# EAGLE design audio-interface (EAGLE 6.3)
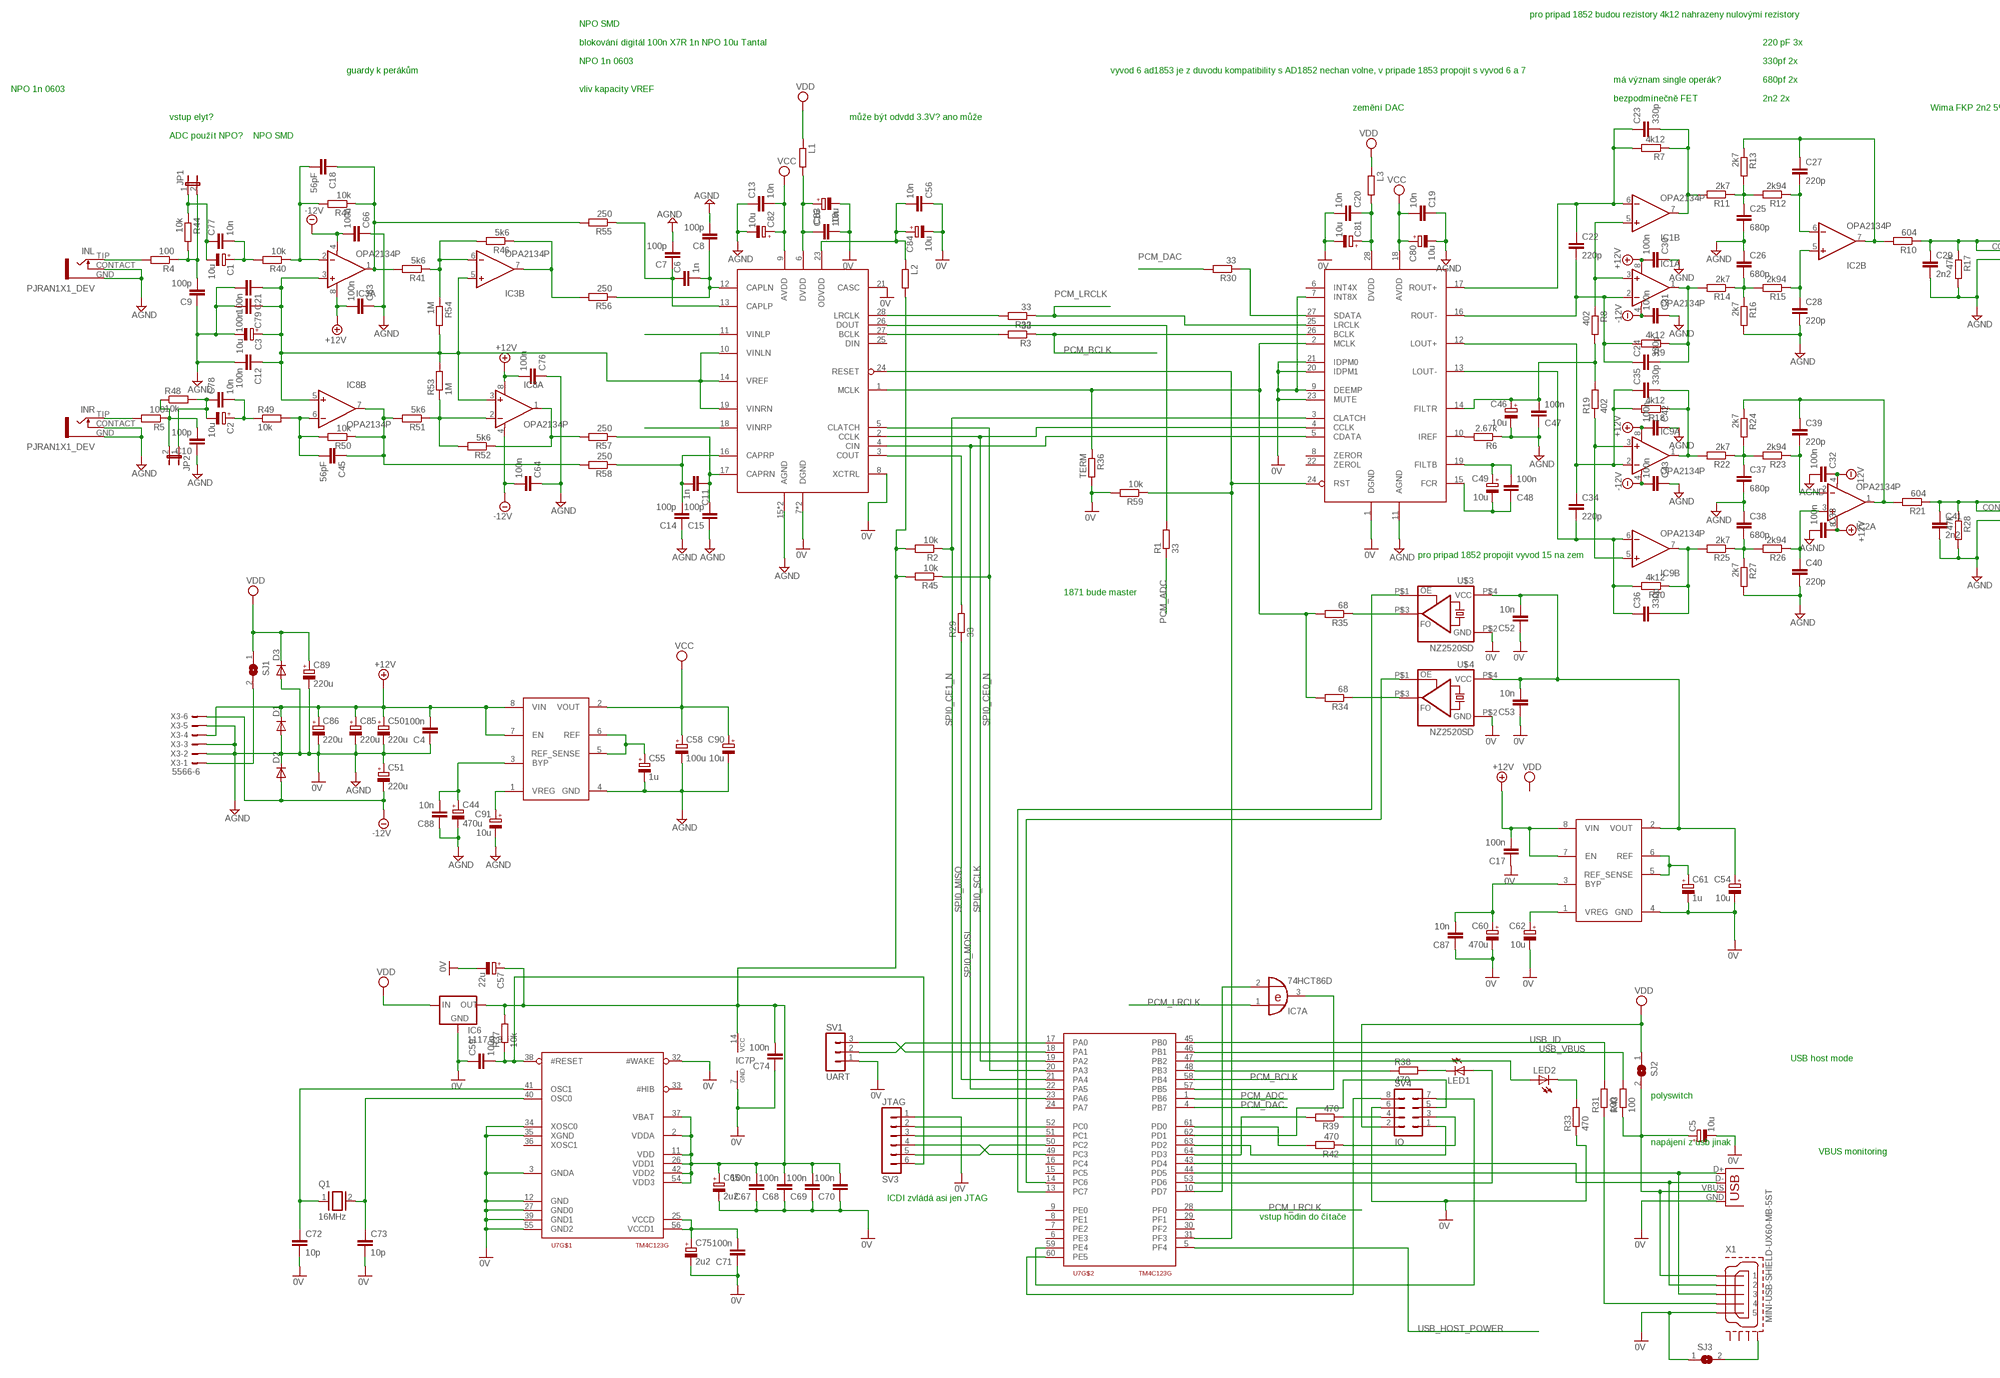
[diagram p0: schematic, sheet 1, part 1 of 2]
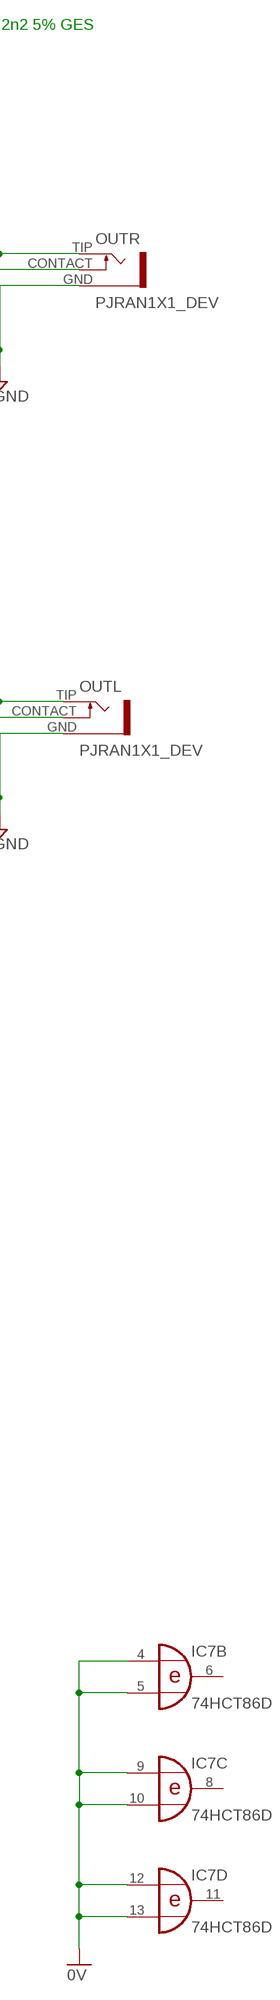
[diagram p1: schematic, sheet 1, part 2 of 2]

## Parts
C1  10u  CPOL-EUE2.5-5  [E2,5-5]
C2  10u  CPOL-EUE2.5-5  [E2,5-5]
C3  10u  CPOL-EUE2.5-7  [E2,5-7]
C4  100n  C-EUC0805  [C0805]
C5  10u  CPOL-EUE2.5-7  [E2,5-7]
C6  1n  C-EUC0805K  [C0805K]
C7  100p  C-EUC0805K  [C0805K]
C8  100p  C-EUC0805K  [C0805K]
C9  100p  C-EUC0805K  [C0805K]
C10  100p  C-EUC0805K  [C0805K]
C11  1n  C-EUC0805K  [C0805K]
C12  100n  C-EUC0805  [C0805]
C13  10n  C-EUC0805  [C0805]
C14  100p  C-EUC0805K  [C0805K]
C15  100p  C-EUC0805K  [C0805K]
C16  10n  C-EUC0805  [C0805]
C17  100n  C-EUC0805  [C0805]
C18  56pF  C-EUC0805K  [C0805K]
C19  10n  C-EUC0805  [C0805]
C20  10n  C-EUC0805  [C0805]
C21  100n  C-EUC0805  [C0805]
C22  220p  C-EUC0805K  [C0805K]
C23  330p  C-EUC0805K  [C0805K]
C24  330p  C-EUC0805K  [C0805K]
C25  680p  C-EU050-050X075  [C050-050X075]
C26  680p  C-EU050-050X075  [C050-050X075]
C27  220p  C-EUC0805K  [C0805K]
C28  220p  C-EUC0805K  [C0805K]
C29  2n2  C-EU050-050X075  [C050-050X075]
C30  100n  C-EUC0805  [C0805]
C31  100n  C-EUC0805  [C0805]
C32  100n  C-EUC0805  [C0805]
C33  100n  C-EUC0805  [C0805]
C34  220p  C-EUC0805K  [C0805K]
C35  330p  C-EUC0805K  [C0805K]
C36  330p  C-EUC0805K  [C0805K]
C37  680p  C-EU050-050X075  [C050-050X075]
C38  680p  C-EU050-050X075  [C050-050X075]
C39  220p  C-EUC0805K  [C0805K]
C40  220p  C-EUC0805K  [C0805K]
C41  2n2  C-EU050-050X075  [C050-050X075]
C42  100n  C-EUC0805  [C0805]
C43  100n  C-EUC0805  [C0805]
C44  470u  CPOL-EUE2.5-7  [E2,5-7]
C45  56pF  C-EUC0805K  [C0805K]
C46  10u  CPOL-EUSMCA  [SMC_A]
C47  100n  C-EUC0805  [C0805]
C48  100n  C-EUC0805  [C0805]
C49  10u  CPOL-EUSMCA  [SMC_A]
C50  220u  CPOL-EUE2.5-7  [E2,5-7]
C51  220u  CPOL-EUE2.5-7  [E2,5-7]
C52  10n  C-EUC0805  [C0805]
C53  10n  C-EUC0805  [C0805]
C54  10u  CPOL-EUCT6032  [CT6032]
C55  1u  CPOL-EUCT3216  [CT3216]
C56  10n  C-EUC0805  [C0805]
C57  22u  CPOL-EUCT6032  [CT6032]
C58  100u  CPOL-EUE2.5-7  [E2,5-7]
C59  100n  C-EUC0805  [C0805]
C60  470u  CPOL-EUE2.5-7  [E2,5-7]
C61  1u  CPOL-EUCT3216  [CT3216]
C62  10u  CPOL-EUCT6032  [CT6032]
C63  100n  C-EUC0805  [C0805]
C64  100n  C-EUC0805  [C0805]
C65  2u2  CPOL-EUCT3216  [CT3216]
C66  100n  C-EUC0805  [C0805]
C67  100n  C-EUC0805  [C0805]
C68  100n  C-EUC0805  [C0805]
C69  100n  C-EUC0805  [C0805]
C70  100n  C-EUC0805  [C0805]
C71  100n  C-EUC0805  [C0805]
C72  10p  C-EUC0805  [C0805]
C73  10p  C-EUC0805  [C0805]
C74  100n  C-EUC0805  [C0805]
C75  2u2  CPOL-EUCT3216  [CT3216]
C76  100n  C-EUC0805  [C0805]
C77  10n  C-EUC0805K  [C0805K]
C78  10n  C-EUC0805K  [C0805K]
C79  100n  C-EUC0805  [C0805]
C80  10u  CPOL-EUSMCA  [SMC_A]
C81  10u  CPOL-EUSMCA  [SMC_A]
C82  10u  CPOL-EUSMCA  [SMC_A]
C83  10u  CPOL-EUSMCA  [SMC_A]
C84  10u  CPOL-EUSMCA  [SMC_A]
C85  220u  CPOL-EUE2.5-7  [E2,5-7]
C86  220u  CPOL-EUE2.5-7  [E2,5-7]
C87  10n  C-EUC0805  [C0805]
C88  10n  C-EUC0805  [C0805]
C89  220u  CPOL-EUE2.5-7  [E2,5-7]
C90  10u  CPOL-EUCT6032  [CT6032]
C91  10u  CPOL-EUCT6032  [CT6032]
D1  DIODE-MINIMELF  [MINIMELF]
D2  DIODE-MINIMELF  [MINIMELF]
D3  DIODE-MINIMELF  [MINIMELF]
IC1  OPA2134P  [DIL08]
IC2  OPA2134P  [DIL08]
IC3  OPA2134P  [DIL08]
IC6  1117 3.3  LM1117  [SOT223]
IC7  74HCT86D  [SO14]
IC8  OPA2134P  [DIL08]
IC9  OPA2134P  [DIL08]
INL  PJRAN1X1_DEV  [PJRAN1X1]
INR  PJRAN1X1_DEV  [PJRAN1X1]
JP1  JP1E  [JP1]
JP2  JP1E  [JP1]
L1  R-EU_R0805  [R0805]
L2  R-EU_R0805  [R0805]
L3  R-EU_R0805  [R0805]
LED1  LED3MM  [LED3MM]
LED2  LED3MM  [LED3MM]
OUTL  PJRAN1X1_DEV  [PJRAN1X1]
OUTR  PJRAN1X1_DEV  [PJRAN1X1]
Q1  16MHz  XTAL/S  [QS]
R1  33  R-EU_R0805  [R0805]
R2  10k  R-EU_R0805  [R0805]
R3  33  R-EU_R0805  [R0805]
R4  100  R-EU_M0805  [M0805]
R5  100  R-EU_M0805  [M0805]
R6  2.67k  R-EU_M1406  [M1406]
R7  4k12  R-EU_M1206  [M1206]
R8  402  R-EU_M1206  [M1206]
R9  4k12  R-EU_M1206  [M1206]
R10  604  R-EU_M1206  [M1206]
R11  2k7  R-EU_M1206  [M1206]
R12  2k94  R-EU_M1206  [M1206]
R13  2k7  R-EU_M1206  [M1206]
R14  2k7  R-EU_M1206  [M1206]
R15  2k94  R-EU_M1206  [M1206]
R16  2k7  R-EU_M1206  [M1206]
R17  47k  R-EU_M1206  [M1206]
R18  4k12  R-EU_M1206  [M1206]
R19  402  R-EU_M1206  [M1206]
R20  4k12  R-EU_M1206  [M1206]
R21  604  R-EU_M1206  [M1206]
R22  2k7  R-EU_M1206  [M1206]
R23  2k94  R-EU_M1206  [M1206]
R24  2k7  R-EU_M1206  [M1206]
R25  2k7  R-EU_M1206  [M1206]
R26  2k94  R-EU_M1206  [M1206]
R27  2k7  R-EU_M1206  [M1206]
R28  47k  R-EU_M1206  [M1206]
R29  33  R-EU_R0805  [R0805]
R30  33  R-EU_R0805  [R0805]
R31  100  R-EU_R0805  [R0805]
R32  33  R-EU_R0805  [R0805]
R33  470  R-EU_R0805  [R0805]
R34  68  R-EU_M1206  [M1206]
R35  68  R-EU_M1206  [M1206]
R36  TERM  R-EU_R0805  [R0805]
R37  10k  R-EU_R0805  [R0805]
R38  470  R-EU_R0805  [R0805]
R39  470  R-EU_R0805  [R0805]
R40  10k  R-EU_M1206  [M1206]
R41  5k6  R-EU_M1206  [M1206]
R42  470  R-EU_R0805  [R0805]
R43  100  R-EU_R0805  [R0805]
R44  10k  R-EU_M1206  [M1206]
R45  10k  R-EU_R0805  [R0805]
R46  5k6  R-EU_M1206  [M1206]
R47  10k  R-EU_M1206  [M1206]
R48  10k  R-EU_M1206  [M1206]
R49  10k  R-EU_M1206  [M1206]
R50  10k  R-EU_M1206  [M1206]
R51  5k6  R-EU_M1206  [M1206]
R52  5k6  R-EU_M1206  [M1206]
R53  1M  R-EU_M1206  [M1206]
R54  1M  R-EU_M1206  [M1206]
R55  250  R-EU_M1206  [M1206]
R56  250  R-EU_M1206  [M1206]
R57  250  R-EU_M1206  [M1206]
R58  250  R-EU_M1206  [M1206]
R59  10k  R-EU_R0805  [R0805]
SJ1  SJ  [SJ]
SJ2  SJ  [SJ]
SJ3  SJ  [SJ]
SV1  UART  MA03-1  [MA03-1]
SV3  JTAG  MA06-1  [MA06-1]
SV4  IO  MA04-2  [MA04-2]
U1  AD1853  [SSOP-28]
U2  AD1871  [SSOP-28]
U5  ADM7150  [SO8-COOL]
U6  ADM7150  [SO8-COOL]
U7  TM4C123G  [LQFP64]
U$3  NZ2520SD  OSC-3ST  [OSC2X2.5]
U$4  NZ2520SD  OSC-3ST  [OSC2X2.5]
X1  MINI-USB-SHIELD-UX60-MB-5ST  [UX60-MB-5ST]
X3  5566-6  [5566-6]
X7  USB-B-H  [USB-B-H]

## Nets
+12V: C4.2 C17.2 C30.2 C33.1 C42.2 C50.+ C63.2 C76.2 C85.+ C86.+ D1.C IC1.8(A:V+) IC2.8(A:V+) IC3.8(A:V+) IC8.8(A:V+) IC9.8(A:V+) U5.7(EN) U5.8(VIN) U6.7(EN) U6.8(VIN) X3.4
-12V: C31.2 C32.1 C43.2 C51.- C64.2 C66.2 D2.A IC1.4(A:V-) IC2.4(A:V-) IC3.4(A:V-) IC8.4(A:V-) IC9.4(A:V-) X3.6
AGND: C3.- C4.1 C5.- C7.2 C8.2 C9.1 C10.1 C12.2 C13.1 C14.1 C15.1 C16.2 C17.1 C19.1 C20.2 C21.2 C25.2 C26.1 C28.2 C29.2 C30.1 C31.1 C32.2 C33.2 C37.2 C38.1 C40.2 C41.2 C42.1 C43.1 C44.- C46.- C47.1 C50.- C51.+ C52.1 C53.1 C54.- C55.- C56.1 C57.- C58.- C59.1 C60.- C61.- C62.- C63.1 C64.1 C65.- C66.1 C67.1 C68.1 C69.1 C70.1 C71.1 C72.2 C73.2 C74.1 C75.- C76.1 C79.2 C80.- C81.- C82.- C83.- C84.- C85.- C86.- C87.1 C88.1 C89.- C90.- C91.- D1.A D2.C D3.A IC6.1(GND) IC7.4(B:I0) IC7.5(B:I1) IC7.7(P:GND) IC7.9(C:I0) IC7.10(C:I1) IC7.12(D:I0) IC7.13(D:I1) INL.CONTACT(SWITCH) INL.GND INR.CONTACT(SWITCH) INR.GND OUTL.GND OUTR.GND R6.1 R16.2 R17.2 R27.2 R28.2 R33.1 R36.2 R59.2 SJ3.1 SV1.1 SV3.1 SV4.6 U1.1(DGND) U1.7(INT8X) U1.9(DEEMP) U1.11(AGND) U1.20(IDPM1) U1.21(IDPM0) U1.23(MUTE) U2.7(DGND) U2.8(XCTRL) U2.15(AGND) U2.20(AGND) U2.21(CASC) U2.22(DGND) U5.4(GND) U6.4(GND) U7.3(GNDA) U7.12(GND) U7.27(GND0) U7.32(#WAKE) U7.34(XOSC0) U7.35(XGND) U7.39(GND1) U7.55(GND2) U$3.P$2(GND) U$4.P$2(GND) X1.5 X3.2 X3.3 X3.5 X7.GND ; supply symbol labelled 0V
N$1: R59.1 U1.24(RST) U2.24(RESET) U7.31(PF3)
N$2: R35.1 U$3.P$3(FO)
N$3: R32.2 U2.28(LRCLK)
N$4: IC7.3(A:O) U7.57(PB5)
N$5: R1.2 U2.26(DOUT)
N$6: C55.+ U5.5(REF_SENSE) U5.6(REF)
N$7: C91.+ U5.1(VREG)
N$8: C44.+ C88.2 U5.3(BYP)
N$9: R34.2 R35.2 R36.1 U1.2(MCLK) U2.1(MCLK)
N$10: C6.2 C8.1 R56.1 U2.12(CAPLN)
N$11: R29.2 U2.3(COUT)
N$12: C60.+ C87.2 U6.3(BYP)
N$13: C62.+ U6.1(VREG)
N$14: C61.+ U6.5(REF_SENSE) U6.6(REF)
N$15: C1.+ C77.2 R40.2
N$16: IC3.7(B:OUT) R46.1 R56.2
N$17: C71.2 C75.+ U7.25(VCCD) U7.56(VCCD1)
N$18: C22.2 C24.1 IC1.2(A:-IN) R9.2 U1.16(ROUT-)
N$19: C6.1 C7.1 R55.1 U2.13(CAPLP)
N$20: C45.1 IC8.7(B:OUT) R50.1 R51.2 R58.2
N$21: C11.1 C15.2 R57.1 U2.17(CAPRN)
N$22: C22.1 C23.1 IC1.6(B:-IN) R7.2 U1.17(ROUT+)
N$23: SV1.3 U7.18(PA1)
N$24: IC8.1(A:OUT) R52.1 R57.2
N$25: C24.2 IC1.1(A:OUT) R9.1 R14.2
N$26: C11.2 C14.2 R58.1 U2.16(CAPRP)
N$27: IC8.2(A:-IN) R51.1 R52.2 R53.1
N$28: IC3.6(B:-IN) R41.1 R46.2 R54.1
N$29: C3.+ C12.1 C21.1 C79.1 IC3.3(A:+IN) IC3.5(B:+IN) IC8.3(A:+IN) IC8.5(B:+IN) R53.2 R54.2 U2.10(VINLN) U2.14(VREF) U2.19(VINRN)
N$30: C23.2 IC1.7(B:OUT) R7.1 R11.2
N$31: C46.+ C47.2 R8.2 R19.2 U1.14(FILTR)
N$32: C26.2 R14.1 R15.2 R16.1
N$33: R6.2 U1.10(IREF)
N$34: C25.1 R11.1 R12.2 R13.2
N$35: C27.2 IC2.6(B:-IN) R12.1
N$36: C28.1 IC2.5(B:+IN) R15.1
N$37: C27.1 IC2.7(B:OUT) R10.2 R13.1
N$38: C48.2 C49.+ U1.19(FILTB)
N$39: C29.1 OUTR.CONTACT(SWITCH) OUTR.TIP(HOT) R10.1 R17.1
N$40: C48.1 C49.- U1.15(FCR)
N$41: SV3.5 U7.50(PC2)
N$42: C34.2 C36.1 IC9.6(B:-IN) R20.2 U1.13(LOUT-)
N$43: C36.2 IC9.7(B:OUT) R20.1 R25.2
N$44: IC9.3(A:+IN) IC9.5(B:+IN) R19.1
N$45: C35.2 IC9.1(A:OUT) R18.1 R22.2
N$46: C38.2 R25.1 R26.2 R27.1
N$47: C37.1 R22.1 R23.2 R24.2
N$48: C39.2 IC2.2(A:-IN) R23.1
N$49: C40.1 IC2.3(A:+IN) R26.1
N$50: C39.1 IC2.1(A:OUT) R21.2 R24.1
N$51: R3.2 U2.27(BCLK)
N$52: IC1.3(A:+IN) IC1.5(B:+IN) R8.1
N$53: C18.1 IC3.1(A:OUT) R41.2 R47.1 R55.2
N$54: INR.TIP(HOT) R5.2
N$55: C10.2 JP2.2 R5.1 R48.1
N$56: R34.1 U$4.P$3(FO)
N$57: C34.1 C35.1 IC9.2(A:-IN) R18.2 U1.12(LOUT+)
N$58: C2.+ C78.2 R49.1
N$59: C72.1 Q1.1 U7.41(OSC1)
N$60: C52.2 C53.2 C54.+ U6.2(VOUT) U$3.P$4(VCC) U$4.P$4(VCC)
N$61: C45.2 IC8.6(B:-IN) R49.2 R50.2
N$62: C73.1 Q1.2 U7.40(OSC0)
N$63: SV4.1 U7.63(PD2)
N$64: SV1.2 U7.17(PA0)
N$65: R39.2 U7.64(PD3)
N$66: SV3.4 U7.49(PC3)
N$67: LED1.A U7.53(PD6)
N$68: C18.2 IC3.2(A:-IN) R40.1 R47.2
N$69: C9.2 JP1.2 R4.1 R44.2
N$70: INL.TIP(HOT) R4.2
N$71: U7.44(PD5) X1.3 X7.D+
N$72: U7.43(PD4) X1.2 X7.D-
N$73: C59.2 R37.1 SV3.6 U7.38(#RESET)
N$74: SV3.2 U7.52(PC0)
N$75: SV3.3 U7.51(PC1)
N$76: IC7.2(A:I1) U7.10(PD7)
N$77: LED2.K(C) R33.2
N$78: LED1.K(C) R38.2
N$79: U7.14(PC6) U$4.P$1(OE)
N$80: U7.13(PC7) U$3.P$1(OE)
N$81: R42.2 U7.61(PD0)
N$82: U2.11(VINLP)
N$83: C16.1 C83.+ L1.2 U2.6(DVDD)
N$84: C56.2 C84.+ L2.1 U2.23(ODVDD)
N$85: R38.1 U7.48(PB3)
N$86: U2.18(VINRP)
N$87: C57.+ C65.+ C67.2 C68.2 C69.2 C70.2 C74.2 IC6.2(OUT) IC7.14(P:VCC) L2.2 R2.2 R37.2 R45.2 U7.2(VDDA) U7.11(VDD) U7.26(VDD1) U7.37(VBAT) U7.42(VDD2) U7.54(VDD3)
N$88: R30.1 U1.27(SDATA)
N$89: R39.1 SV4.4
N$90: SV4.8 U7.60(PE5)
N$91: SV4.5 U7.62(PD1)
N$92: R42.1 SV4.3
N$93: SV4.7 U7.59(PE4)
N$94: C1.- C77.1 JP1.1 R44.1
N$95: C2.- C78.1 JP2.1 R48.2
N$96: LED2.A U7.47(PB2)
N$97: C20.1 C81.+ L3.2 U1.28(DVDD)
N$98: SJ1.2 X3.1
N$99: C5.+ R43.1 SJ2.2 X1.1 X7.VBUS
N$101: R31.1 X1.4
N$102: SJ3.2 X1.M4(GND4)
OUTL: C41.1 OUTL.CONTACT(SWITCH) OUTL.TIP(HOT) R21.1 R28.1
PCM_ADC: R1.1 U7.1(PB6)
PCM_BCLK: R3.1 U1.26(BCLK) U7.58(PB4)
PCM_DAC: R30.2 U7.4(PB7)
PCM_LRCLK: IC7.1(A:I0) R32.1 U1.25(LRCLK) U7.28(PF0)
SPI0_CE0_N: R45.1 U2.5(CLATCH) U7.20(PA3)
SPI0_CE1_N: R2.1 U1.3(CLATCH) U7.23(PA6)
SPI0_MISO: R29.1 U7.21(PA4)
SPI0_MOSI: U1.5(CDATA) U2.4(CIN) U7.22(PA5)
SPI0_SCLK: U1.4(CCLK) U2.2(CCLK) U7.19(PA2)
USB_HOST_POWER: U7.5(PF4)
USB_ID: R31.2 U7.45(PB0)
USB_VBUS: R43.2 U7.46(PB1)
VCC: C13.2 C19.2 C58.+ C80.+ C82.+ C90.+ U1.18(AVDD) U2.9(AVDD) U5.2(VOUT)
VDD: C89.+ D3.C IC6.3(IN) L1.1 L3.1 SJ1.1 SJ2.1 SV4.2
Unconnected: IC7.6(B:O) IC7.8(C:O) IC7.11(D:O) U1.6(INT4X) U1.8(ZEROR) U1.22(ZEROL) U2.25(DIN) U7.6(PE3) U7.7(PE2) U7.8(PE1) U7.9(PE0) U7.15(PC5) U7.16(PC4) U7.24(PA7) U7.29(PF1) U7.30(PF2) U7.33(#HIB) U7.36(XOSC1) X1.M1(GND1) X1.M2(GND2) X1.M3(GND3)

## Notes on the sheet
- pro pripad 1852 budou rezistory 4k12 nahrazeny nulovými rezistory
- NPO SMD
- blokování digitál 100n X7R 1n NPO 10u Tantal | 220 pF 3x
- NPO 1n 0603 | 330pf 2x
- guardy k perákům | vyvod 6 ad1853 je z duvodu kompatibility s AD1852 nechan volne, v pripade 1853 propojit s vyvod 6 a 7
- má význam single operák? | 680pf 2x
- NPO 1n 0603 | vliv kapacity VREF
- bezpodmínečně FET | 2n2 2x
- zemění DAC | Wima FKP 2n2 5% GES
- vstup elyt? | může být odvdd 3.3V? ano může
- ADC použít NPO? | NPO SMD
- pro pripad 1852 propojit vyvod 15 na zem
- 1871 bude master
- USB host mode
- polyswitch
- napájení z usb jinak
- VBUS monitoring
- ICDI zvládá asi jen JTAG
- vstup hodin do čítače

## Library data of the parts
C1-C3 C5 C44 C46 C49-C51 C54 C55 C57 C58 C60-C62 C65 C75 C80-C86 C89-C91 = rcl:CPOL-EU: POLARIZED CAPACITOR, European symbol
C4 C6-C43 C45 C47 C48 C52 C53 C56 C59 C63 C64 C66-C74 C76-C79 C87 C88 = rcl:C-EU: CAPACITOR, European symbol
D1-D3 = diode:DIODE-: DIODE
IC1-IC3 IC8 IC9 = burr-brown:OPA2134: Operational Amplifier; MF: TEXAS INSTRUMENTS; MPN: OPA2134PA; OC_FARNELL: 1097574; OC_NEWARK: 74K3897
IC6 = v-reg-3:LM1117
IC7 = 74xx-eu:74*86: Quad 2-input EXCLUSIVE-OR (XOR) gate
INL INR OUTL OUTR = cinch:PJRAN1X1_DEV
JP1 JP2 = jumper:JP1E: JUMPER
L1-L3 R1-R59 = rcl:R-EU_: RESISTOR, European symbol
LED1 LED2 = led:LED: LED OSRAM: - CHIPLED LG R971, LG N971, LY N971, LG Q971, LY Q971, LO R971, LY R971 LH N974, LH R974 LS Q976, LO Q976, LY Q976 LO Q996 - Hyper CHIPLED LW Q18S LB Q993, LB Q99A, LB R99A - SideLED LS A670, LO A670, LY A670, LG A670, LP A670 LB A673, LV A673, LT A673, LW A673 LH A674 LY A675 LS A676, LA A676, LO A676, LY A676, LW A676 LS A679, LY A679, LG A679 - Hyper Micro SIDELED® LS Y876, LA Y876, LO Y876, LY Y876 LT Y87S - SmartLED LW L88C, LW L88S LB L89C, LB L89S, LG L890 LS L89K, LO L89K, LY L89K LS L896, LA L896, LO L896, LY L896 - TOPLED LS T670, LO T670, LY T670, LG T670, LP T670 LSG T670, LSP T670, LSY T670, LOP T670, LYG T670 LG T671, LOG T671, LSG T671 LB T673, LV T673, LT T673, LW T673 LH T674 LS T676, LA T676, LO T676, LY T676, LB T676, LH T676, LSB T676, LW T676 LB T67C, LV T67C, LT T67C, LS T67K, LO T67K, LY T67K, LW E67C LS E67B, LA E67B, LO E67B, LY E67B, LB E67C, LV E67C, LT E67C LW T67C LS T679, LY T679, LG T679 LS T770, LO T770, LY T770, LG T770, LP T770 LB T773, LV T773, LT T773, LW T773 LH T774 LS E675, LA E675, LY E675, LS T675 LS T776, LA T776, LO T776, LY T776, LB T776 LHGB T686 LT T68C, LB T68C - Hyper Mini TOPLED® LB M676 - Mini TOPLED Santana® LG M470 LS M47K, LO M47K, LY M47K Source: http://www.osram.convergy.de LUXEON: - LUMILED® LXK2-PW12-R00, LXK2-PW12-S00, LXK2-PW14-U00, LXK2-PW14-V00 LXK2-PM12-R00, LXK2-PM12-S00, LXK2-PM14-U00 LXK2-PE12-Q00, LXK2-PE12-R00, LXK2-PE12-S00, LXK2-PE14-T00, LXK2-PE14-U00 LXK2-PB12-K00, LXK2-PB12-L00, LXK2-PB12-M00, LXK2-PB14-N00, LXK2-PB14-P00, LXK2-PB14-Q00 LXK2-PR12-L00, LXK2-PR12-M00, LXK2-PR14-Q00, LXK2-PR14-R00 LXK2-PD12-Q00, LXK2-PD12-R00, LXK2-PD12-S00 LXK2-PH12-R00, LXK2-PH12-S00 LXK2-PL12-P00, LXK2-PL12-Q00, LXK2-PL12-R00 Source: www.luxeon.com KINGBRIGHT: KA-3528ASYC Source: www.kingbright.com
Q1 = special:XTAL/S: CRYSTAL
SJ1-SJ3 = jumper:SJ: SMD solder JUMPER
SV1 = con-lstb:MA03-1: PIN HEADER; OC_FARNELL: unknown; OC_NEWARK: unknown
SV3 = con-lstb:MA06-1: PIN HEADER; OC_FARNELL: unknown; OC_NEWARK: unknown
SV4 = con-lstb:MA04-2: PIN HEADER; OC_FARNELL: unknown; OC_NEWARK: unknown
U1 = analog-devices:AD1853
U2 = analog-devices:AD1871
U5 U6 = analog-devices:ADM7150
U7 = tm4c123:TM4C123G: TM4C123G micro in LQFP64 package
U$3 U$4 = ndk:OSC-3ST
X1 = usb_con-update:MINI-USB-SHIELD-: MINI USB Connector Source: http://www.hirose.co.jp/cataloge_hp/e24000019.pdf
X3 = con-molex:5566-6: Mini FIT connector 6 pol Source: http://www.molex.com; MPN: 95566-61002; OC_FARNELL: unknown; OC_NEWARK: 22K8620
X7 = con-usb:USB: USB Connectors

## Board
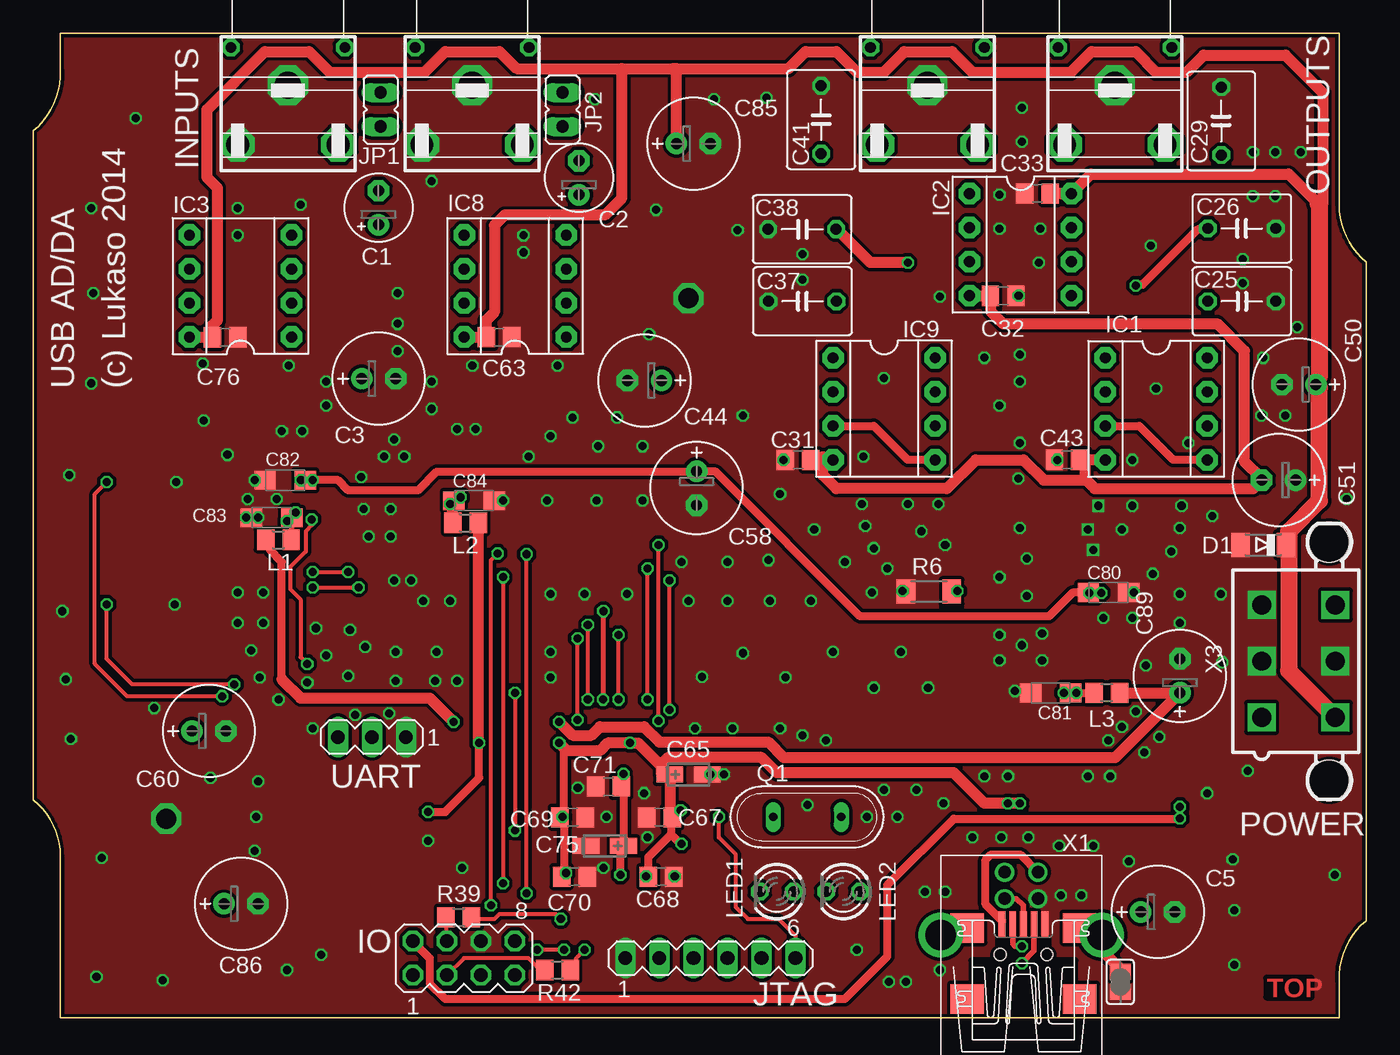
[diagram p2: board, top side]
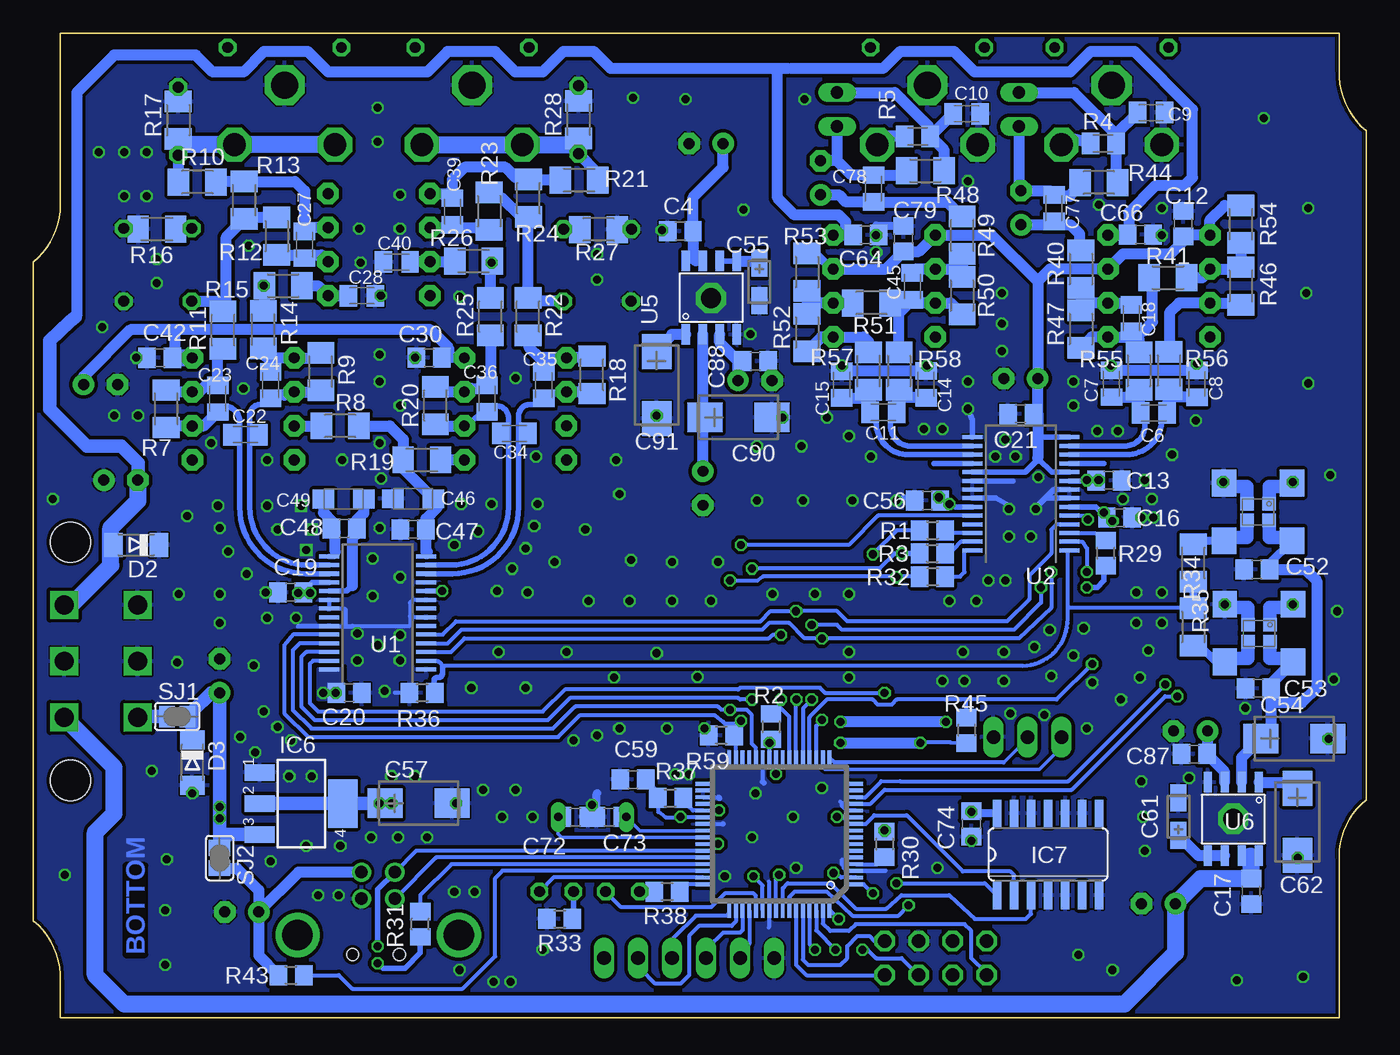
[diagram p3: board, bottom side, seen from below]

Size 99.5 x 73.5 mm. Coordinates in mm from the lower left corner, seen from the top.
Outline: 2,12.05 arc51 0,16.25 0,66.25 arc52 2,70.75 2,73.5 97.5,73.5 97.5,60.73 arc51 99.5,56.43 99.5,7.25 arc52 97.5,2.75 97.5,0 2,0 2,12
Copper layers (1*16): Top 0.035mm / dielectric 1.5mm / Bottom 0.035mm
Design rules "ITEADstudio_DRC *": minimum track width 6mil, minimum drill 12mil, track to track 6mil, track to pad 6mil, pad to pad 6mil, via to via 6mil, smd to smd 0mil, copper to edge 10mil, drill to drill 10mil, minimum pad ring 10mil, minimum via ring 6mil, stop-mask expansion 2mil, vias tented up to drill 100mil, thermal gap 5mil

### Footprints (pad centres in the part's own frame; a part is rotated, then mirrored left to right if it is on the bottom)
E2,5-5 = drill 0.813 pad 1.6: + -1.27,0 | drill 0.813 pad 1.6 octagon: - 1.27,0
E2,5-7 = drill 0.813 pad 1.6: + -1.27,0 | drill 0.813 pad 1.6 octagon: - 1.27,0
C0805 = smd 1.3 x 1.5: 1 -0.95,0; 2 0.95,0
C0805K = smd 1.3 x 1.6: 1 -1,0; 2 1,0
C050-050X075 = drill 0.813 octagon: 1 -2.54,0; 2 2.54,0
SMC_A = smd 1.6 x 1.4: + -1.5,0; - 1.5,0
CT6032 = smd 2.6 x 2.2: + -2.5,0; - 2.5,0
CT3216 = smd 2 x 1.2: + -1.4,0; - 1.4,0
MINIMELF = smd 1.4 x 1.8: A 1.7,0; C -1.7,0
DIL08 = drill 0.813 pad 1.6 octagon: 1 -3.81,-3.81; 2 -1.27,-3.81; 3 1.27,-3.81; 4 3.81,-3.81; 5 3.81,3.81; 6 1.27,3.81; 7 -1.27,3.81; 8 -3.81,3.81
SOT223 = smd 1.219 x 2.235: 1 -2.311,-3.099; 2 0,-3.099; 3 2.311,-3.099 | smd 3.6 x 2.2: 4 0,3.099
SO14 = smd 0.66 x 2.032: 1 -3.81,-3.073; 2 -2.54,-3.073; 3 -1.27,-3.073; 4 0,-3.073; 5 1.27,-3.073; 6 2.54,-3.073; 7 3.81,-3.073; 8 3.81,3.073; 9 2.54,3.073; 10 1.27,3.073; 11 0,3.073; 12 -1.27,3.073; 13 -2.54,3.073; 14 -3.81,3.073
PJRAN1X1 = drill 1.7 pad 2.54 octagon: CONTACT -3.75,-8.05; TIP 3.75,-8.05 | drill 2 pad 3 octagon: GND 0,-3.6 | drill 0.8 pad 1.016 octagon: P$1 4.25,-0.8; P$2 -4.25,-0.8
JP1 = drill 0.914 long: 1 0,-1.27; 2 0,1.27
R0805 = smd 1.3 x 1.5: 1 -0.95,0; 2 0.95,0
LED3MM = drill 0.813 octagon: A -1.27,0; K 1.27,0
QS = drill 0.61 long: 1 -2.54,0; 2 2.54,0
M0805 = smd 1.3 x 1.6: 1 -0.95,0; 2 0.95,0
M1406 = smd 1.4 x 1.8: 1 -1.7,0; 2 1.7,0
M1206 = smd 1.6 x 2: 1 -1.4,0; 2 1.4,0
SJ = smd 1.168 x 1.6: 1 -0.762,0; 2 0.762,0
MA03-1 = drill 1.016 long: 1 -2.54,0; 2 0,0; 3 2.54,0
MA06-1 = drill 1.016 long: 1 -6.35,0; 2 -3.81,0; 3 -1.27,0; 4 1.27,0; 5 3.81,0; 6 6.35,0
MA04-2 = drill 1.016 octagon: 1 -3.81,-1.27; 2 -3.81,1.27; 3 -1.27,-1.27; 4 -1.27,1.27; 5 1.27,-1.27; 6 1.27,1.27; 7 3.81,-1.27; 8 3.81,1.27
SSOP-28 = smd 0.3 x 1.5: 1 -4.225,-3.625; 2 -3.575,-3.625; 3 -2.925,-3.625; 4 -2.275,-3.625; 5 -1.625,-3.625; 6 -0.975,-3.625; 7 -0.325,-3.625; 8 0.325,-3.625; 9 0.975,-3.625; 10 1.625,-3.625; 11 2.275,-3.625; 12 2.925,-3.625; 13 3.575,-3.625; 14 4.225,-3.625; 15 4.225,3.625; 16 3.575,3.625; 17 2.925,3.625; 18 2.275,3.625; 19 1.625,3.625; 20 0.975,3.625; 21 0.325,3.625; 22 -0.325,3.625; 23 -0.975,3.625; 24 -1.625,3.625; 25 -2.275,3.625; 26 -2.925,3.625; 27 -3.575,3.625; 28 -4.225,3.625
SO8-COOL = smd 0.61 x 1.524: 1 -1.905,-2.743; 2 -0.635,-2.743; 3 0.635,-2.743; 4 1.905,-2.743; 5 1.905,2.743; 6 0.635,2.743; 7 -0.635,2.743; 8 -1.905,2.743
LQFP64 = smd 1.1 x 0.285: 1 -5.7,3.75; 2 -5.7,3.25; 3 -5.7,2.75; 4 -5.7,2.25; 5 -5.7,1.75; 6 -5.7,1.25; 7 -5.7,0.75; 8 -5.7,0.25; 9 -5.7,-0.25; 10 -5.7,-0.75; 11 -5.7,-1.25; 12 -5.7,-1.75; 13 -5.7,-2.25; 14 -5.7,-2.75; 15 -5.7,-3.25; 16 -5.7,-3.75; 33 5.7,-3.75; 34 5.7,-3.25; 35 5.7,-2.75; 36 5.7,-2.25; 37 5.7,-1.75; 38 5.7,-1.25; 39 5.7,-0.75; 40 5.7,-0.25; 41 5.7,0.25; 42 5.7,0.75; 43 5.7,1.25; 44 5.7,1.75; 45 5.7,2.25; 46 5.7,2.75; 47 5.7,3.25; 48 5.7,3.75 | smd 0.285 x 1.1: 17 -3.75,-5.7; 18 -3.25,-5.7; 19 -2.75,-5.7; 20 -2.25,-5.7; 21 -1.75,-5.7; 22 -1.25,-5.7; 23 -0.75,-5.7; 24 -0.25,-5.7; 25 0.25,-5.7; 26 0.75,-5.7; 27 1.25,-5.7; 28 1.75,-5.7; 29 2.25,-5.7; 30 2.75,-5.7; 31 3.25,-5.7; 32 3.75,-5.7; 49 3.75,5.7; 50 3.25,5.7; 51 2.75,5.7; 52 2.25,5.7; 53 1.75,5.7; 54 1.25,5.7; 55 0.75,5.7; 56 0.25,5.7; 57 -0.25,5.7; 58 -0.75,5.7; 59 -1.25,5.7; 60 -1.75,5.7; 61 -2.25,5.7; 62 -2.75,5.7; 63 -3.25,5.7; 64 -3.75,5.7
OSC2X2.5 = smd 1 x 1: 1 0,-1.25; 2 1.65,-1.25; 3 1.65,0; 4 0,0 | smd 1.8 x 2: P$1 -1.714,-2.794; P$2 3.365,-2.794; P$3 3.365,1.524; P$4 -1.714,1.524
UX60-MB-5ST = smd 2 x 0.5: 1 2.25,1.6; 2 2.25,0.8; 3 2.25,0; 4 2.25,-0.8; 5 2.25,-1.6 | smd 2.2 x 2.5: M1 -3.3,-4.2; M2 -3.3,4.2; M3 2,4.2; M4 2,-4.2 | hole 0.9: 0,-1.75; 0,1.75
5566-6 = drill 1.4 square: 1 4.2,-2.75; 2 0,-2.75; 3 -4.2,-2.75; 4 4.2,2.75; 5 0,2.75; 6 -4.2,2.75 | hole 3: 8.9,2.29; -8.9,2.29
USB-B-H = drill 0.914: D+ 0,1.25; D- 1.981,1.25; GND 0,-1.25; VBUS 1.981,-1.25 | drill 2.286: P$1 -2.718,-6.02; P$2 -2.718,6.02

### Placement (x,y rotation side)
C1  25.76,60.49 90 top
C2  40.73,62.73 90 top
C3  25.78,47.73 0 top
C4  51.2,58.73 0 bottom
C5  83.95,7.89 0 top
C6  15.84,45.16 0 bottom
C7  19.01,47.35 90 bottom
C8  12.63,47.34 90 bottom
C9  16.04,67.6 180 bottom
C10  29.81,67.5 180 bottom
C11  36.03,45.21 0 bottom
C12  13.65,59.29 90 bottom
C13  19.19,40.13 180 bottom
C14  32.85,47.29 270 bottom
C15  39.15,47.28 270 bottom
C16  18.4,37.34 0 bottom
C17  8.57,9.43 90 bottom
C18  17.52,52.25 90 bottom
C19  80.3,31.77 0 bottom
C20  75.94,24.26 0 bottom
C21  25.79,45.09 180 bottom
C22  83.67,43.54 0 bottom
C23  85.74,46.23 90 bottom
C24  81.79,47.25 90 bottom
C25  90.23,53.5 0 top
C26  90.23,58.94 180 top
C27  79.26,57.72 270 bottom
C28  74.99,53.92 0 bottom
C29  88.69,66.96 90 top
C30  69.96,49.28 0 bottom
C31  57.09,41.65 0 top
C32  72.41,53.9 0 top
C33  74.97,61.55 180 top
C34  63.6,43.63 180 bottom
C35  61.39,47.25 90 bottom
C36  65.63,46.23 90 bottom
C37  57.42,53.5 180 top
C38  57.39,58.88 0 top
C39  68.22,60.2 270 bottom
C40  72.38,56.43 180 bottom
C41  58.81,67.06 90 top
C42  90.07,49.28 0 bottom
C43  77.18,41.66 0 top
C44  45.62,47.59 180 top
C45  33.88,54.62 90 bottom
C46  71.15,38.75 180 bottom
C47  71.15,36.47 0 bottom
C48  76.3,36.53 0 bottom
C49  76.34,38.74 180 bottom
C50  94.49,47.28 180 top
C51  92.98,40.14 180 top
C52  8.16,33.47 0 bottom
C53  8.04,24.6 0 bottom
C54  5.36,20.84 0 bottom
C55  45.3,54.95 270 bottom
C56  32.75,38.63 0 bottom
C57  70.74,16.02 0 bottom
C58  49.52,39.54 270 top
C59  54.74,17.78 0 bottom
C60  13.1,21.41 0 top
C61  14.01,15.02 90 bottom
C62  5.12,14.63 270 bottom
C63  34.76,50.82 180 top
C64  37.35,58.46 180 bottom
C65  48.91,18.16 0 top
C66  16.84,58.48 180 bottom
C67  46.74,14.97 0 top
C68  46.87,10.53 180 top
C69  40.26,14.97 180 top
C70  40.39,10.53 180 top
C71  42.93,17.26 0 top
C72  59.04,14.99 0 bottom
C73  56.5,14.99 180 bottom
C74  29.47,14.47 90 bottom
C75  42.66,12.83 180 top
C76  14.32,50.81 180 top
C77  23.3,60.46 270 bottom
C78  36.78,61.92 270 bottom
C79  34.55,58.17 90 bottom
C80  80.27,31.75 0 top
C81  75.95,24.26 180 top
C82  18.8,40.14 180 top
C83  17.78,37.34 180 top
C84  32.9,38.61 0 top
C85  49.28,65.28 0 top
C86  15.5,8.51 0 top
C87  12.83,19.69 0 bottom
C88  45.6,49.03 180 bottom
C89  85.6,25.53 90 top
C90  46.87,44.84 0 bottom
C91  52.96,47.25 270 bottom
D1  91.83,35.31 180 top
D2  91.83,35.31 180 bottom
D3  87.63,19.05 270 bottom
IC1  83.84,45.47 270 top
IC2  73.7,57.73 270 top
IC3  15.46,54.64 90 top
IC6  79.51,15.99 270 bottom
IC7  23.74,12.2 0 bottom
IC8  35.97,54.64 90 top
IC9  63.52,45.47 270 top
INL  19,73.25 0 top
INR  32.75,73.25 0 top
JP1  25.91,67.82 0 top
JP2  39.5,67.82 0 top
L1  18.29,35.69 0 top
L2  32.26,36.96 0 top
L3  80.14,24.26 180 top
LED1  55.5,9.42 180 top
LED2  60.46,9.42 180 top
OUTL  66.75,73.25 0 top
OUTR  80.75,73.25 0 top
Q1  57.77,14.99 180 top
R1  32.37,36.39 0 bottom
R2  44.43,21.74 270 bottom
R3  32.39,34.67 0 bottom
R4  19.63,65.3 180 bottom
R5  33.49,65.83 180 bottom
R6  66.85,31.82 0 top
R7  89.59,45.47 270 bottom
R8  76.6,44.2 0 bottom
R9  78.04,48.26 270 bottom
R10  87.26,62.41 0 bottom
R11  85.35,51.34 270 bottom
R12  81.34,58.35 90 bottom
R13  83.76,61.04 270 bottom
R14  82.34,51.38 270 bottom
R15  80.86,54.67 180 bottom
R16  90.28,58.9 180 bottom
R17  88.69,67.02 90 bottom
R18  57.8,48.01 270 bottom
R19  70.5,41.66 180 bottom
R20  69.49,45.72 270 bottom
R21  58.77,62.55 180 bottom
R22  62.57,52.35 270 bottom
R23  65.47,60.23 90 bottom
R24  62.54,61.21 270 bottom
R25  65.39,52.34 270 bottom
R26  66.64,56.49 0 bottom
R27  57.3,58.86 0 bottom
R28  58.81,67.06 90 bottom
R29  19.43,34.69 90 bottom
R30  35.95,12.96 270 bottom
R31  70.62,6.99 90 bottom
R32  32.38,32.93 0 bottom
R33  60.22,7.37 0 bottom
R34  12.89,29.17 90 bottom
R35  12.89,33.95 270 bottom
R36  70.47,24.26 180 bottom
R37  51.95,16.4 0 bottom
R38  52.19,9.4 180 bottom
R39  31.75,7.5 0 top
R40  21.28,55.9 90 bottom
R41  14.78,55.27 180 bottom
R42  39.12,3.56 0 top
R43  80.27,3.18 0 bottom
R44  19.94,62.36 0 bottom
R45  29.83,21.47 270 bottom
R46  9.35,54.65 90 bottom
R47  21.28,51.43 90 bottom
R48  32.9,63.25 180 bottom
R49  30.15,58.42 270 bottom
R50  30.16,53.92 90 bottom
R51  36.93,53.37 0 bottom
R52  41.74,51.17 90 bottom
R53  41.74,55.67 90 bottom
R54  9.35,59.26 90 bottom
R55  16.95,48.3 90 bottom
R56  14.72,48.32 90 bottom
R57  37.16,48.28 90 bottom
R58  34.86,48.3 90 bottom
R59  48.14,21.09 180 bottom
SJ1  88.78,22.48 180 bottom
SJ2  85.6,11.93 270 bottom
SJ3  81.16,2.67 90 top
SV1  25.28,20.96 180 top
SV3  50.55,4.45 0 top
SV4  32.13,4.45 0 top
U1  73.8,30.23 90 bottom
U2  25.77,39.12 90 bottom
U5  48.9,53.77 0 bottom
U6  9.91,14.84 180 bottom
U7  43.8,13.72 180 bottom
U$3  7.24,37.14 180 bottom
U$4  7.17,28.08 180 bottom
X1  73.92,4.7 90 top
X3  94.46,26.62 270 top
X7  73.76,8.89 90 top

### Tracks (layer width: path | path; a pad name or v marks a point on that pad's centre or on a via)
+12V
  Top 0.305: IC2.8 77.8,61.54 | D1.C 93.53,35.74 93.73,35.95
  Top 0.813: 43.95,70.87 36.07,70.87 34.8,72.14 30.74,72.14 29.21,70.62 22.1,70.62 20.58,72.14 17.28,72.14 12.96,67.82 12.96,62.74 13.72,61.98 13.72,52.07 13.34,51.69 13.34,50.84 C76.2 | 43.95,70.87 47.76,70.87 | 47.76,70.87 48.01,70.87 | 48.01,70.87 56.39,70.87 57.66,72.14 59.95,72.14 61.47,70.62 63.5,70.62 65.03,72.14 68.58,72.14 70.11,70.62 77.47,70.62 79,72.14 82.3,72.14 83.82,70.62 86.11,70.62 87.38,71.89 93.48,71.89 96.27,69.09 96.27,60.71 96.14,60.58 | IC8.8 33.8,50.83 C63.2 33.79,50.84 33.79,52.07 34.42,52.71 34.42,59.19 35.18,59.95 42.68,59.95 43.95,61.22 43.95,70.87 | 13.21,50.97 C76.2 | IC3.8 13.35,50.83 C76.2 | IC2.8 C33.1 | 76.78,61.54 76.78,61.53 76.97,61.53 76.97,61.54 IC2.8 | 95.91,60.82 93.73,63 78.96,63 IC2.8 | 96.02,60.71 96.14,60.58 | 96.14,60.58 96.02,60.58 | 48.01,70.62 47.76,70.87 | C85.+ 48.01,70.87
  Top 1.27: X3.4 93.73,25.9 93.73,35.95 93.73,36.33 96.02,38.61 96.02,47.03 C50.+ 96.02,47.92 96.02,60.58 | 96.02,60.71 95.91,60.82
  Bottom 0.406: U5.7 50.04,56.52 U5.8 | U6.8 8.03,12.07 8.64,12.07 8.66,12.09 U6.7
  Bottom 0.813: 67.33,49.29 IC9.8 68.52,49.28 | 89.16,51.38 69.85,51.38 68.52,50.04 68.52,49.28 | C42.2 88.9,49.28 88.9,51.12 89.16,51.38 | 50.04,56.52 50.25,56.73 C4.2 50.25,61.26 48.01,63.5 C85.+ | 89.16,51.38 92.27,51.38 95.76,47.88 C50.+ | 68.52,49.28 C30.2 68.52,49.28
  Bottom 1.27: 8.64,12.07 8.64,11.94 8.57,11.88 C17.2 12.36,10.38 C86.+ 14.23,4.83 18.04,1.02 92.71,1.02 94.87,3.18 94.87,13.85 93.48,15.24 93.48,18.69 X3.4 | IC1.8 C42.2
-12V
  Top 0.305: C43.2 IC1.4
  Top 0.813: IC1.4 78.49,41.66 78.49,40.14 | IC2.4 69.91,53.9 C32.1 71.46,52.76 72.39,51.82 88.4,51.82 90.43,49.79 90.43,41.53 91.71,40.25 C51.- 91.07,39.5 79.25,39.5 78.62,40.14 78.49,40.14 | 58.93,41.65 58.93,40.52 59.95,39.5 68.2,39.5 70.36,41.66 73.92,41.66 75.44,40.14 78.49,40.14
  Top 1.27: C31.2 58.93,41.65 IC9.4
  Bottom 0.305: 43.18,70.87 43.18,70.62 42.93,70.87 | D2.A 93.6,35.31 93.73,35.44 | 91.7,40.13 91.7,40.64 | 91.7,40.12 91.7,40.13 | 91.7,40.13 C51.-
  Bottom 0.813: 43.18,70.87 43.95,70.87 | 43.95,70.87 56.39,70.87 57.66,72.14 59.95,72.14 61.47,70.62 63.5,70.62 65.03,72.14 68.58,72.14 70.11,70.62 77.47,70.62 79,72.14 82.3,72.14 83.82,70.62 86.11,70.62 87.38,71.89 93.48,71.89 96.27,69.09 96.27,52.48 96.78,51.97 | 42.93,70.87 36.07,70.87 34.8,72.14 30.74,72.14 29.21,70.62 22.1,70.62 20.58,72.14 17.28,72.14 12.96,67.82 12.96,62.74 13.53,62.17 15.69,62.17 17.73,60.13 17.73,58.55 C66.2 17.82,58.45 IC3.4 | 38.87,58.42 38.87,59.44 39.37,59.95 42.68,59.95 43.95,61.22 43.95,70.87 | 38.87,58.42 38.33,58.42 C64.2 | IC8.4 38.89,58.45 38.87,58.42
  Bottom 1.016: 91.7,40.14 91.7,40.64 91.7,41.41 92.97,42.68 95.51,42.68 98.3,45.47 98.3,50.55 96.78,51.97 96.4,52.33
  Bottom 1.27: 91.7,40.12 91.7,38.61 93.73,36.58 93.73,35.44 93.73,33.79 96.69,30.82 X3.6
AGND  (via drill 0.6, 1.5, 1.5 pad 1.68)
  Top 0.406: X1.5 75.52,7.07 75.57,7.12
  Bottom 0.254: C73.2 C72.2
  Bottom 0.305: U1.20 U1.21 76.28,30.55 76.2,30.48 76.2,29.25 75.7,29.25 | 75.7,29.25 71.38,29.25 71.38,29.98 | U1.9 71.17,31.2 71.38,30.99 71.38,29.98 | U1.7 71.31,29.91 71.38,29.98 | R36.2 72.52,24.26 | 70.78,26 U1.1 | U1.23 79.72,29.25 79.76,29.21 75.74,29.21 75.7,29.25 | U7.27 45.05,17.62 | U7.35 48.35,16.47 | U7.39 48.02,14.47 | U7.3 35.85,10.97 38.75,10.96 38.78,10.96 38.99,11.18 38.99,11.31 39.12,11.43 39.12,11.81 | U7.12 38.79,15.47 39.12,15.8 39.12,16.01 39.25,16.13 | U7.55 44.55,10.14 44.58,10.16 44.58,6.74
  Bottom 0.406: U2.15 29.39,44.63 v29.72,45.47 | U2.8 23.3,39.45 23.95,38.8 | U2.7 23.95,38.8 | 23.95,38.8 24.39,38.36 | U2.20 26.38,40.09 | U2.22 27.62,38.8 26.42,38.1 | C56.1 34.51,38.88 34.52,38.87 | 45.05,17.62 44.96,17.53 | 48.35,16.47 48.26,16.39 | 48.02,14.47 48.01,14.48
  Bottom 0.61: C73.2 57.45,16.72 57.41,16.77 | C79.2 36.51,59.12 36.58,59.19 36.58,58.63 C64.1
  Bottom 0.813: C8.2 C7.2 | 39.14,48.26 C15.1 39.13,48.29 C14.1 | C38.1 55.88,58.88 R27.2
  other vias: 21.85,45.72 21.85,47.5 27.18,54.11 27.18,51.82 27.18,49.79 26.17,41.91 36.58,58.42 36.58,57.15 24.45,40.39 26.67,35.95 24.64,37.98 12.64,48.84 19.05,48.71 15.24,58.42 15.24,60.46 4.32,60.46 4.45,54.11 38.61,43.44 26.93,43.18 27.69,41.91 26.67,37.98 29.72,47.5 32.77,48.71 65.28,38.36 66.3,36.33 39.12,48.71 73.66,36.58 68.08,35.31 62.74,35.06 62.11,36.71 61.85,38.36 63.76,33.53 62.62,31.75 79.12,34.93 82.17,31.75 81.28,36.45 82.05,38.23 83.57,33.15 84.97,34.8 85.6,36.58 85.73,38.23 88.02,37.47 82.05,41.66 61.98,41.91 73.66,49.53 73.66,47.5 72.14,45.72 83.82,46.99 63.5,47.76 72.14,61.47 72.14,58.93 75.19,58.93 75.06,56.39 73.56,53.92 23.63,28.96 29.98,25.15 56.14,25.4 52.96,27.22 27.05,27.31 30.1,27.31 27.05,25.15 23.5,25.53 21.85,27.05 21.09,29.09 17.15,29.47 17.15,31.75 15.24,31.75 45.85,13.47 45.6,16.77 40.64,17.15 42.8,14.99 61.47,5.08 65.92,17.02 57.79,15.88 72.14,26.67 75.31,26.67 74.17,34.29 72.14,32.9 74.17,31.5 72.14,28.58 75.31,28.71 73.79,27.82 66.81,24.64 62.74,24.64 73.28,24.39 64.77,27.31 82.94,19.82 87.63,16.77 32.01,11.18 4.32,47.38 12.7,44.58 14.48,42.04 2.42,25.28 2.16,30.36 2.67,40.52 42.04,38.61 40.26,44.84 51.82,34.04 54.87,34.17 72.78,18.04 89.67,3.94 89.67,8.01 97.16,10.67 98.05,38.74 4.7,3.05 9.66,2.8 9.91,14.86 48.9,53.73 16.77,17.66 16.64,14.99 16.51,12.45 21.47,4.7 18.93,3.56 63.89,2.67 65.16,2.67 66.55,9.4 83.44,57.66 50.55,18.16 26.93,32.64 28.2,32.64 29.09,31.12 31.12,31.12 38.61,31.63 41.15,31.63 51.82,31.12 54.99,31.12 58.04,31.12 52.2,21.59 57.41,21.09 59.19,20.7 71,18.04 67.95,16.01 49.41,21.59 55.76,21.59 59.69,27.31 15.24,29.47 16.77,37.34 80.27,20.7 80.39,18.04 82.3,22.86 83.06,26.29 79.89,29.85 82.05,29.85 85.6,31.63 63.5,17.02 62.23,14.99 64.52,14.99 89.54,11.81 76.71,9.15 78.24,9.15 79.12,12.83 76.58,12.83 16.51,40.14 18.16,38.74 16.01,38.74 25.02,35.95 18.55,43.82 20.07,43.82 31.63,43.95 33.02,43.95 24.01,22.61 26.55,22.74 20.83,21.59 16.89,25.4 51.57,18.16 38.61,27.31 38.61,25.4 35.06,38.61 38.36,38.61 45.47,38.61 36.96,41.91 42.17,42.68 45.47,42.68 55.76,39.12 58.3,36.45 64.9,31.88 45.98,51.06 52.96,44.96 43.56,44.84 5.08,11.94 2.8,20.83 13.21,17.91 29.47,13.21 44.33,31.63 48.39,34.04 48.9,31.12 49.91,25.44 85.6,29.47 72.27,13.47 74.3,13.47 70.11,13.47 81.79,11.69 24.77,27.69 31.63,25.15 90.3,56.65 90.3,54.87 91.83,49.28 76.46,41.66 71,49.28 56.01,41.66 57.41,55.12 57.41,57.03 73.79,67.95 73.79,65.41 92.71,64.65 91.06,64.65 94.62,64.65 93.48,44.96 91.7,44.96 60.58,34.04 68.08,9.4 67.69,3.56 94.36,51.57 86.24,42.93 91.06,61.34 92.71,61.34 78.74,18.04 84.08,20.96 88.78,26.55 88.65,31.63 90.68,18.42 73.54,40.26 79.51,38.23 67.57,38.36 67.69,53.85 19.94,60.71 7.62,67.19 29.72,62.49 41.91,68.58 50.8,68.58 54.74,68.71 52.58,58.8 46.49,60.33 73.66,42.93 20.45,25.02 18.29,23.75 15.88,37.34 81.28,21.72 47.88,10.54 42.55,11.18 78.74,36.45 9.02,23.12 16.26,27.44 10.67,40.01 10.54,30.86
  pour Top (isolate 0.254, rank 2, no thermals): 0,73.41 99.44,73.41 99.57,73.54 99.57,0.13 99.44,0 0,0
  pour Bottom (isolate 0.254, rank 2): 0,73.54 99.44,73.54 99.44,0 0,0
N$1  (via drill 0.6)
  Top 0.305: v46.68,22.17 v46.68,35.31
  Bottom 0.305: U2.24 36.43,37.49 38.61,35.31 v46.68,35.31 | U1.24 80.11,28.61 80.78,27.82 80.78,22.74 79,20.96 60.33,20.96 58.68,22.61 48.65,22.61 48.01,22.1 47.88,21.98 46.87,21.98 v46.68,22.17 | U7.31 47.05,21.09 47.05,21.15 46.68,21.52 v46.68,22.17 | 46.74,22.1 v46.68,22.17
  Bottom 0.61: R59.1 47.05,21.09
N$2
  Bottom 0.61: U$3.P$3 12.64,35.61 R35.1
N$3
  Bottom 0.305: U2.28 29.88,34.9 29.98,34.8 29.98,33.28 30.32,32.93 R32.2
N$4
  Bottom 0.305: U7.57 43.55,9.67 43.18,10.04 40.01,10.04 38.1,8.13 35.82,8.13 34.67,9.15 31.12,9.15 29.21,7.37 25.4,7.37 25.02,7.75 25.02,9.11 IC7.3
N$5
  Bottom 0.305: U2.26 31.23,36.2 R1.2
N$6
  Bottom 0.406: U5.6 U5.5
  Bottom 0.813: U5.5 45.47,56.52 C55.+
N$7
  Bottom 0.61: 51.83,51.03 51.83,50.88 C91.+
  Bottom 0.813: U5.1 51.83,51.03
N$8
  Bottom 0.813: U5.3 48.26,50.42 46.97,49.13 46.57,49.13 C88.2 46.89,48.81 C44.+
N$9
  Bottom 0.305: 22.25,30.74 22.28,29.77 arc90 25.65,26.27 68.86,26.27 68.97,26.17 arc-90 69.58,26.66 U1.2 | 22.25,30.74 22.25,34.89 U2.1 | 69.47,24.31 arc90 R36.1 69.52,24.82 arc-90 69.6,24.9 | 22.25,30.74 arc-90 22.03,30.61 12.93,30.61 R34.2
  Bottom 0.406: 68.97,26.17 68.97,25.66 arc90 69.35,25.4 arc-90 69.6,25.15 69.6,24.9
  Bottom 0.61: R35.2 R34.2
N$10
  Bottom 0.406: U2.12 17.91,42.05 arc-90 15.24,44.71 15.24,44.76 arc90 C6.2
  Bottom 0.813: C8.1 14.37,46.34 | 14.37,46.34 14.8,45.91 14.8,45.2 C6.2 | R56.1 14.72,46.7 14.37,46.34
N$11
  Bottom 0.305: U2.3 20.24,36.2 R29.2
N$12
  Bottom 0.813: U6.3 10.54,18.35 C87.2 11.83,19.74 C60.+
N$13
  Bottom 0.813: U6.1 5.57,17.58 C62.+
N$14
  Bottom 0.813: U6.6 U6.5 12.48,12.09 C61.+
N$15
  Bottom 0.813: 21.4,57.92 21.4,58.55 22.07,59.22 23.25,59.22 23.3,59.27 C77.2 23.54,59.22 C1.+ | 21.4,57.92 21.4,57.42 | R40.2 21.28,57.8 21.4,57.92
N$16
  Bottom 0.813: R46.1 9.35,53.37 IC3.7 13.95,53.37 14.67,52.65 14.67,49.77 R56.2
N$17  (via drill 0.6)
  Top 0.305: 43.82,12.21 C75.+ 44.05,12.46
  Top 0.406: 44.05,16.97 C71.2 44.05,16.84
  Top 0.61: v44.05,18.2 44.05,16.84 44.05,12.46 | v43.82,10.67 43.82,12.21
  Bottom 0.305: U7.25 44.05,18.34 | U7.56 44.05,10.44 v43.82,10.67
  Bottom 0.406: 44.05,18.34 v44.05,18.2
N$18
  Bottom 0.305: C22.2 83.24,43.54 83.34,43.44
  Bottom 0.406: U1.16 79.05,33.8 arc90 83.34,38.1 83.34,43.44 83.34,44.84 arc90 82.64,45.8 82.24,45.8 arc-90 C24.1 81.29,46.49
  Bottom 0.813: R9.2 78.17,46.74 IC1.2 80.53,46.74 80.78,46.49 81.29,46.49
N$19
  Bottom 0.406: U2.13 18.02,42.7 arc-90 16.51,44.2 16.51,44.83 arc-90 C6.1
  Bottom 0.813: C7.1 17.33,46.35 16.96,45.98 | 16.96,45.98 16.89,45.91 16.89,45.21 C6.1 | R55.1 16.95,45.99 16.96,45.98
N$20
  Bottom 0.813: C45.1 33.63,53.37 IC8.7 31.01,53.37 R50.1 | C45.1 33.88,53.5 33.85,53.47 | R58.2 34.86,52.63 C45.1 | R51.2 34.12,53.37 C45.1
N$21
  Bottom 0.406: 37.09,45.15 arc90 C11.1 arc90 36.58,44.76 36.58,44.45 arc-90 34.17,42.05 U2.17
  Bottom 0.813: C15.2 37.07,46.28 | 37.07,46.28 37.02,46.23 C11.1 | R57.1 37.16,46.37 37.07,46.28
N$22
  Bottom 0.305: C22.1 84.21,43.54 84.11,43.44
  Bottom 0.406: U1.17 79.16,33.16 arc90 84.11,38.1 84.11,43.44 84.11,44.35 arc-90 85.18,45.68 85.55,45.42 C23.1
  Bottom 0.813: R7.2 89.46,44.2 IC1.6 86.77,44.2 C23.1
N$23
  Bottom 0.254: SV1.3 22.74,20.2 24.39,18.55 40.39,18.55 40.55,18.71 U7.18
N$24
  Bottom 0.813: R57.2 37.15,50.49 37.5,50.83 IC8.1 40.67,50.83 R52.1
N$25
  Bottom 0.813: R9.1 78.43,49.28 IC1.1 81.54,49.28 81.79,49.03 | R14.2 82.34,49.57 81.79,49.03 | 81.79,49.03 C24.2
N$26
  Bottom 0.406: U2.16 34.06,42.7 arc90 35.5,44.2 35.5,44.74 C11.2 arc-90 35.31,44.93 35.31,44.71
  Bottom 0.813: C14.2 34.93,46.29 | 34.93,46.29 34.99,46.23 34.99,45.25 C11.2 | R58.1 34.86,46.36 34.93,46.29
N$27
  Bottom 0.813: R51.1 IC8.2 41.69,53.37 | 41.69,53.37 41.72,53.41 41.72,54.25 R53.1 | R52.2 41.74,53.32 41.69,53.37
N$28
  Bottom 0.813: R54.1 R46.2 9.35,55.91 IC3.6 11.65,55.86 12.26,55.25 13.37,55.25 R41.1
N$29
  Bottom 0.406: U2.10 23.47,40.74 24.45,41.72 | 24.45,41.72 24.52,41.79 | U2.19 25.43,40.74 24.45,41.72 | U2.14 24.47,43.34 24.51,43.31 | C21.1 24.57,45.09 24.51,45.15
  Bottom 0.61: IC8.3 39.91,55.91 41.02,57.03 41.7,57.03 R53.2
  Bottom 0.813: R54.2 10.56,60.66 11.65,59.57 IC3.5 13.54,58.45 C12.1 13.65,57.98 14.61,57.03 18.15,57.03 IC3.3 23.6,55.91 24.51,55 | IC8.3 35.86,55.91 C79.1 33.39,57.22 IC8.5 27.95,58.45 24.51,55 | 24.52,41.79 24.51,41.8 24.51,43.31 24.51,45.15 C3.+ 24.51,55
N$30
  Bottom 0.406: 89.71,46.49 R7.1
  Bottom 0.813: R7.1 89.45,46.74 IC1.7 87.13,46.74 86.62,47.25 85.76,47.25 C23.2 85.74,49.55 R11.2
N$31
  Bottom 0.406: U1.14 70.11,34.45 70.11,34.8
  Bottom 0.813: 70.11,34.8 70.2,34.8 C47.2 70.2,37.25 69.35,38.1 69.35,38.45 C46.+ 71.9,41 R19.2 71.89,41.68 71.89,43.18 72.9,44.2 R8.2
N$32  (via drill 0.6)
  Top 0.61: 87.63,58.88 86.95,58.88 82.81,54.74 82.36,54.74 v82.3,54.68
  Top 0.813: 87.64,58.94 C26.2 87.63,58.88
  Bottom 0.813: R15.2 82.29,54.67 | 82.29,54.67 v82.3,54.68 | 82.29,54.67 82.29,53.21 R14.1 | R16.1 87.73,58.9 C26.2
N$33  (via drill 0.6)
  Top 0.406: R6.2 68.78,31.82 68.84,31.88 69.03,31.88 v69,31.86
  Bottom 0.406: v69,31.86 U1.10
N$34
  Bottom 0.813: R11.1 85.1,53.34 | 85.1,53.34 85.1,58.3 R13.2 83.65,59.75 R12.2 | C25.1 85.25,53.5 85.1,53.34
N$35
  Bottom 0.813: R12.1 79.25,56.95 | 79.25,56.95 78,56.95 IC2.6 | C27.2 79.26,56.94 79.25,56.95
N$36
  Bottom 0.813: C28.1 IC2.5 78.25,54.67 R15.1
N$37
  Bottom 0.813: IC2.7 78.98,59 C27.1 79.26,60.45 79.25,60.46 79.25,61.73 79.97,62.44 R13.1 85.83,62.44 R10.2
N$38
  Bottom 0.305: 75.44,36.44 C48.2
  Bottom 0.406: U1.19 76.1,31.85 75.7,32.26
  Bottom 0.813: C49.+ 74.84,37.69 75.44,37.09 75.44,36.62 C48.2 | 75.44,36.44 75.44,36.07 75.7,35.82 75.7,32.26
N$39
  Bottom 0.813: R10.1 88.66,64.39 C29.1 R17.1 88.27,65.2
  Bottom 1.27: OUTR.CONTACT OUTR.TIP 88.27,65.2
N$40
  Bottom 0.305: 77.43,36.35 C48.1
  Bottom 0.406: U1.15 77.06,34.45 76.97,34.55 76.97,34.8
  Bottom 0.813: 76.97,34.8 76.97,36.25 C48.1 77.22,36.56 77.22,37.09 77.84,37.71 C49.-
N$41
  Bottom 0.305: U7.50 47.05,7.18 47.38,6.86 49.79,6.86 50.55,6.1 50.55,3.18 51.19,2.54 53.09,2.54 54.11,3.56 54.11,4.2 SV3.5
N$42
  Bottom 0.305: C34.2 64.23,43.63 64.04,43.44
  Bottom 0.406: U1.13 68.34,33.8 arc-90 64.04,38.1 64.04,43.44 64.04,44.82 arc-90 64.9,45.68 65.19,45.68 arc-90 C36.1 66.05,45.23 66.85,44.44 67.09,44.44 IC9.6 | 69.36,44.2 R20.2
  Bottom 0.813: 69.36,44.2 IC9.6
N$43
  Bottom 0.813: R25.2 65.39,47.48 C36.2 65.87,46.99 66.81,46.99 67.06,46.74 IC9.7 69.1,46.74 R20.1
N$44
  Top 0.61: IC9.5 65.28,41.66 62.74,44.2 IC9.3
  Bottom 0.813: IC9.5 R19.1
N$45
  Bottom 0.406: 57.68,49.28 R18.1 | IC9.1 60.36,49.28 C35.2
  Bottom 0.813: 57.68,49.28 IC9.1 | 60.36,49.28 61.73,49.28 62.49,50.04 62.49,50.87 R22.2
N$46  (via drill 0.6)
  Top 0.813: C38.2 60,58.88 62.49,56.39 v65.28,56.39
  Bottom 0.813: R26.2 65.24,56.43 v65.28,56.39 65.64,56.03 65.39,55.78 R25.1 | C38.2 58.73,58.88 R27.1
N$47
  Bottom 0.813: C37.1 62.32,53.5 R22.1 62.57,59.77 R24.2 63.11,59.81 64.52,61.22 65.06,61.22 R23.2
N$48
  Bottom 0.813: 66.06,59 R23.1 65.65,59 IC2.2 68.41,59 C39.2
N$49
  Bottom 0.813: R26.1 68.07,56.46 IC2.3 71.34,56.46 C40.1
N$50
  Bottom 0.813: R21.2 62.86,62.55 R24.1 62.67,62.74 63.5,62.74 64.27,63.5 67.31,63.5 68.22,62.6 C39.1 68.56,61.54 IC2.1
N$51
  Bottom 0.305: U2.27 30.25,35.55 30.86,34.93 31.18,34.93 R3.2
N$52
  Top 0.61: IC1.3 82.56,44.2 85.1,41.66 IC1.5
  Bottom 0.813: IC1.3 R8.1
N$53
  Bottom 0.813: R55.2 16.95,50.61 | 16.95,50.61 16.95,50.67 C18.1 16.64,51.25 15.94,51.95 15.94,55.02 R41.2 | 16.95,50.61 17.16,50.83 IC3.1 20.48,50.83 R47.1
N$54
  Bottom 0.813: R5.2 35.87,65.83 INR.TIP
N$55
  Bottom 0.813: JP2.2 35.18,69.09 32.64,66.55 32.64,65.93 R5.1 | C10.2 30.86,67.5 R5.1 | R48.1 31.5,64.78 R5.1
N$56
  Bottom 0.61: U$4.P$3 11.19,26.56 12.32,27.69 12.81,27.69 R34.1
N$57
  Bottom 0.305: C34.1 63.09,43.63 63.28,43.44
  Bottom 0.406: U1.12 68.23,33.16 arc-90 63.28,38.1 63.28,43.44 63.28,44.93 arc90 62.41,45.8 61.84,45.8 C35.1 61.15,46.5 60.71,46.5 60.47,46.74 IC9.2 | 57.68,46.74 R18.2
  Bottom 0.813: 57.68,46.74 IC9.2
N$58
  Bottom 0.813: R49.1 31.25,60.92 C78.2 38.82,60.92 39.36,61.46 C2.+
N$59
  Bottom 0.254: U7.41 60.06,13.47 60.31,13.72 Q1.1
  Bottom 0.305: Q1.1 C72.1
N$60
  Bottom 0.61: C52.2 7.21,33.92 U$3.P$4
  Bottom 0.813: U6.2 9.28,19.43 C54.+ 7.09,21.61 7.09,23.5 | 7.09,23.5 C53.2 7.09,24.92 U$4.P$4 | C52.2 4.52,33.47 3.69,32.64 3.69,24.64 4.83,23.5 7.09,23.5
N$61
  Bottom 0.813: R49.2 30.15,55.95 | 30.15,55.95 R50.2 | 30.15,55.95 30.19,55.91 IC8.6 33.59,55.91 C45.2
N$62
  Bottom 0.254: U7.40 54.21,13.97 Q1.2
  Bottom 0.305: Q1.2 C73.1
N$63
  Bottom 0.305: SV4.1 28.32,3.31 29.47,4.45 29.47,6.48 29.98,6.99 38.1,6.99 38.61,6.48 40.01,6.48 40.55,7.03 U7.63
N$64
  Bottom 0.254: SV1.2 25.28,20.83 27.05,19.05
  Bottom 0.305: 27.05,19.05 39.69,19.05 U7.17
N$65  (via drill 0.6)
  Top 0.305: R39.2 32.83,7.37 34.42,7.37 34.8,7.75 38.99,7.75 v39.37,7.37
  Bottom 0.305: U7.64 40.02,8.02 v39.37,7.37
N$66
  Bottom 0.305: U7.49 47.55,7.83 47.76,7.62 50.04,7.62 51.69,5.97 51.69,4.58 SV3.4
N$67
  Bottom 0.305: U7.53 45.55,9.11 45.72,9.28 47.88,9.28 48.9,8.26 55.62,8.26 LED1.A
N$68
  Bottom 0.813: C18.2 17.64,53.37 IC3.2 20.99,53.37 21.28,53.66 | 21.28,53.66 R47.2 | R40.1 21.28,53.67 21.28,53.66
N$69
  Bottom 0.813: 18.68,65.96 R4.1 18.68,62.49 R44.2 | 18.68,65.96 C9.2 | JP1.2 21.81,69.09 18.68,65.96
N$70
  Bottom 0.813: 22.72,65.23 INL.TIP 22.22,65.73 R4.2
N$71
  Top 0.406: X1.3 73.92,8.39 73.41,8.89 X7.D+
  Bottom 0.305: U7.44 69.43,11.97 X7.D+
N$72  (via drill 0.6)
  Top 0.406: X1.2 73.12,5.5 73.28,5.34 v73.79,5.34
  Bottom 0.305: U7.43 70.92,12.47 X7.D-
  Bottom 0.406: v73.79,5.34 73.79,9.59 X7.D-
N$73  (via drill 0.6)
  Top 0.305: SV3.6 56.9,6.1 55.63,7.37 53.34,7.37 52.45,8.26 52.45,12.2 51.19,13.47 v51.19,14.99
  Bottom 0.305: U7.38 51.04,14.97 v51.19,14.99 51.08,14.97 52.31,14.97 52.84,15.37 52.84,16.21 R37.1 52.9,16.89 C59.2
N$74
  Bottom 0.305: U7.52 46.05,5.52 46.49,5.08 46.49,4.7 SV3.2
N$75
  Bottom 0.305: U7.51 46.55,6.54 46.74,6.35 48.01,6.35 49.15,5.21 49.15,4.58 SV3.3
N$76
  Bottom 0.305: U7.10 37.35,14.47 36.71,15.12 34.29,15.12 30.1,10.93 26.55,10.93 26.28,10.66 IC7.2
N$77
  Bottom 0.406: LED2.K 59.19,7.45 R33.2
N$78
  Bottom 0.305: LED1.K 53.15,9.42 R38.2
N$79  (via drill 0.6)
  Top 0.305: v5.46,30.86 5.46,26.8 7.37,24.9 v14.99,24.9
  Bottom 0.305: U7.14 37.37,16.47 36.31,17.53 36.18,17.67 34.8,17.66 22.23,17.66 v14.99,24.9
  Bottom 0.813: U$4.P$1 v5.46,30.86
N$80  (via drill 0.6)
  Top 0.305: v5.46,40.01 4.58,39.12 4.58,26.42 6.99,24.01 v14.1,24.01
  Bottom 0.305: U7.13 37,15.97 35.95,17.02 21.98,17.02 14.99,24.01 v14.1,24.01
  Bottom 0.813: v5.46,40.01 5.46,39.99 U$3.P$1
N$81  (via drill 0.6)
  Top 0.305: R42.2 40.52,3.5 40.52,4.45 v41.15,5.08
  Bottom 0.305: U7.61 41.55,5.49 v41.15,5.08
N$82
  Bottom 0.406: U2.11 19.58,41.4
N$83  (via drill 0.6)
  Top 0.406: C83.+ 19.28,35.73 L1.2
  Top 0.61: 19.18,35.62 L1.2 | v19.56,37.72 C83.+ 19.03,37.09 v18.93,37.09
  Bottom 0.406: U2.6 20.16,38.15 C16.1 v19.56,37.72
N$84  (via drill 0.6)
  Top 0.305: 31.37,38.59 C84.+
  Top 0.406: 31.55,38.88 31.53,38.87 C84.+ v31.12,38.36
  Top 0.813: L2.1 31.31,38.55 v31.12,38.36
  Bottom 0.406: U2.23 30.65,38.15 v31.12,38.36 31.78,38.87 C56.2
  Bottom 0.61: v31.88,38.87 31.88,38.71 C56.2
N$85
  Bottom 0.305: U7.48 50.67,9.97 R38.1
N$86
  Bottom 0.406: U2.18 32.27,41.4
N$87  (via drill 0.6)
  Top 0.305: v45.72,10.54 45.85,10.59 C68.2 | C69.2 39.49,14.97 v39.5,14.99 | 39.5,10.54 39.45,10.54 C70.2
  Top 0.406: v39.5,14.99 39.63,14.99 | v39.76,10.8 39.63,10.67 39.5,10.54
  Top 0.61: 39.63,10.67 39.63,14.99 39.63,20.13 | C68.2 45.92,12.01 47.6,13.69 | 47.6,13.69 47.63,13.72 47.63,14.91 C67.2 | 47.77,15.02 C67.2 | v33.27,20.52 v33.28,20.5 33.28,17.91 30.74,15.37 v29.47,15.37 | v48.39,12.97 48.31,12.97 47.6,13.69 | v48.33,15.47 48.19,15.47 C67.2
  Top 0.813: v73.66,16.01 v72.78,16.01 71,16.01 68.71,18.29 55.5,18.29 54.36,19.43 47.38,19.43 46.87,18.93 46.91,18.9 46.91,18.76 | L2.2 33.21,20.57 v33.27,20.52 | v39.26,20.5 v39.26,20.52 39.83,19.94 | 46.91,18.76 45.15,20.52 v44.56,20.52 42.87,20.52 42.3,19.94 39.83,19.94 | 46.91,18.76 46.91,18.16 C65.+ 47.51,15.15 C67.2 | 39.83,19.94 39.82,19.94 39.63,20.13
  Bottom 0.305: U7.11 39.1,14.97 | U7.26 v44.55,20.51 | U7.42 v48.39,12.97 | U7.54 45.05,9.88 v45.72,10.54 | U7.2 39.17,10.47 v39.76,10.8 | R2.2 v44.56,20.52 | v48.33,15.47 U7.37 50.27,15.47 50.55,15.75 50.55,15.83 R37.2 | C57.+ 73.65,16.02 v73.66,16.01 | R45.2 31.05,20.57 33.21,20.57 v33.27,20.52
  Bottom 0.406: 39.1,14.97 v39.5,14.99 | v44.55,20.51 v44.56,20.52
  Bottom 0.61: IC7.14 29.32,15.27 C74.2 29.55,15.42 v29.47,15.37
  Bottom 0.813: 73.68,15.99 v73.66,16.01 | v39.26,20.52 v33.27,20.52
  Bottom 1.016: IC6.2 73.68,15.99
N$88  (via drill 0.6)
  Top 0.305: v35.95,24.26 v35.95,13.97
  Bottom 0.305: U1.27 78.64,26.66 78.87,26.42 78.87,23.5 78.24,22.86 61.47,22.86 59.82,24.52 46.87,24.52 46.74,24.64 40.77,24.64 40.39,24.26 v35.95,24.26
  Bottom 0.813: v35.95,13.97 R30.1
N$89
  Top 0.305: SV4.4 30.86,7.44 R39.1
N$90
  Bottom 0.305: U7.60 42.05,4.33 41.66,3.94 39.25,3.94 38.74,4.45 38.74,5.34 37.98,6.1 37.09,6.1 36.71,5.72 SV4.8
N$91  (via drill 0.6)
  Top 0.305: v39.63,5.08 v37.6,5.08
  Bottom 0.305: U7.62 41.05,6.51 v39.63,5.08 | v37.6,5.08 37.22,5.08 36.58,4.45 34.67,4.45 SV4.5
N$92
  Top 0.305: R42.1 38.1,3.31 36.96,4.45 32.13,4.45 SV4.3
N$93
  Bottom 0.305: U7.59 42.55,3.95 41.79,3.18 SV4.7
N$94
  Bottom 0.813: JP1.1 25.91,61.91 C1.- 23.6,61.76 C77.1 23.18,61.34 22.1,61.34 22.1,61.35 R44.1
N$95
  Bottom 0.813: R48.2 34.63,62.92 C78.1 38.41,62.92 39.5,64.01 | 39.5,64.01 40.71,64.01 C2.- | JP2.1 39.5,64.01
N$96
  Bottom 0.305: U7.47 60.67,10.47 LED2.A
N$97  (via drill 0.6)
  Top 0.61: v76.94,24.26 C81.+ v77.86,24.26 L3.2
  Bottom 0.61: 77.43,24.28 v76.94,24.26
  Bottom 0.813: C20.1 v76.94,24.26
  pour Bottom (no thermals): 76.46,26.04 76.46,23.75 78.24,23.75 78.24,26.04
N$98
  Bottom 1.016: SJ1.2 91.65,22.48 X3.1
N$99
  Top 0.406: X1.1 72.32,7.19
  Top 0.61: 72.32,7.19 72.32,7.24 71.09,8.47 71.09,11.78 71.5,12.2 73.69,12.2 X7.VBUS
  Bottom 0.813: X7.VBUS 79.7,10.87 C5.+ | SJ2.2 84.32,11.16 82.68,9.53 C5.+ | C5.+ 82.68,4.64 R43.1
N$101  (via drill 0.6)
  Top 0.406: X1.4 74.72,5 v73.79,4.07
  Bottom 0.406: R31.1 70.62,4.83 71.76,3.69 73.41,3.69 v73.79,4.07
N$102
  Top 0.813: SJ3.2 81.16,3.66 X1.M4
OUTL
  Bottom 0.813: R21.1 57.37,63.08 C41.1
  Bottom 1.27: OUTL.TIP OUTL.CONTACT 59.27,65.2 R28.1 C41.1
PCM_ADC  (via drill 0.6)
  Top 0.305: v36.82,9.28 v36.82,34.61
  Bottom 0.305: U7.1 37.51,9.97 v36.82,9.28 | R1.1 35.04,36.39 v36.82,34.61
PCM_BCLK  (via drill 0.6)
  Top 0.305: v45.84,23.75 v45.84,33.53 | v34.15,8.39 34.15,34.17 v34.66,34.67
  Bottom 0.305: 33.26,34.6 R3.1 | U7.58 43.06,9.02 42.68,9.4 40.26,9.4 38.36,7.62 34.91,7.62 v34.15,8.39 | U1.26 79.13,27.3 79.51,26.93 79.51,23.25 78.49,22.23 61.09,22.23 59.44,23.88 46.87,23.88 46.74,23.75 v45.84,23.75 45.85,23.74 | v34.66,34.67 35.18,34.67 36.33,33.53 v45.84,33.53
  Bottom 0.406: R3.1 v34.66,34.67
PCM_DAC
  Bottom 0.305: U7.4 36.48,11.47 R30.2
PCM_LRCLK  (via drill 0.6)
  Top 0.305: v47.49,22.99 v47.49,32.64 | v35.06,32.9 v35.06,10.04
  Bottom 0.305: U1.25 79.62,27.95 80.14,27.44 80.14,22.99 78.74,21.59 60.71,21.59 59.06,23.25 48.39,23.25 48.14,22.99 v47.49,22.99 46.23,22.99 45.85,22.61 45.85,20.45 45.55,20.15 U7.28 | v35.06,32.9 34.89,32.93 R32.1 45.05,32.93 45.47,32.64 v47.49,32.64 | v35.06,10.04 28.46,10.04 IC7.1
SPI0_CE0_N  (via drill 0.6)
  Top 0.305: v20.78,37.22 20.78,36.78 20.32,36.33 20.32,34.8 19.18,33.66 19.18,32.01 19.94,31.25 19.94,26.93 v20.45,26.42
  Bottom 0.305: U2.5 21.06,37.49 v20.78,37.22 | U7.20 41.55,22.46 40.26,23.75 36.83,23.75 36.45,23.37 35.44,23.37 35.06,23.75 31.37,23.75 | 30.23,23.75 23.12,23.75 v20.45,26.42 | 30.23,23.75 31.37,23.75 | 31.36,23.74 31.37,23.75 | R45.1 29.83,23.74 30.23,23.75
SPI0_CE1_N  (via drill 0.6)
  Top 0.305: v43.68,23.75 v43.68,28.58
  Bottom 0.305: U1.3 68.33,27.3 67.31,28.32 44.58,28.32 44.33,28.58 v43.68,28.58 | U7.23 43.05,22.48 43.82,23.25 | 43.82,23.25 43.82,23.74 v43.68,23.75 | R2.1 44.25,22.81 43.82,23.25
SPI0_MISO  (via drill 0.6)
  Top 0.305: v41.39,23.75 v41.39,29.34 | v20.83,32.13 v24.26,32.13
  Bottom 0.305: U7.21 42.04,19.43 42.04,23.1 v41.39,23.75 | R29.1 19.56,33.15 | v24.26,32.13 24.26,30.99 26.29,28.96 39.12,28.96 39.5,29.34 v41.39,29.34
  Bottom 0.406: v20.83,32.13 20.07,32.13 19.56,32.64 19.56,33.61 R29.1
SPI0_MOSI  (via drill 0.6)
  Top 0.305: 42.53,30.36 v42.53,23.75 42.55,24.4 v42.55,30.36
  Bottom 0.305: U2.4 23.11,36.84 23.5,36.45 23.5,34.67 25.15,33.02 25.15,31.25 26.8,29.59 38.74,29.59 39.5,30.36 v42.55,30.36 44.45,30.36 45.22,29.59 67.95,29.59 68.94,28.61 U1.5 | U7.22 42.55,23.73 v42.53,23.75
SPI0_SCLK  (via drill 0.6)
  Top 0.305: v40.63,22.23 v40.63,28.32 | v20.83,33.28 v23.5,33.28
  Bottom 0.305: U7.19 41.05,21.8 v40.63,22.23 | U1.4 70.17,27.94 68.58,27.94 67.57,28.96 45.09,28.96 44.58,29.47 43.06,29.47 41.91,28.32 v40.63,28.32 25.91,28.32 23.5,30.61 v23.5,33.28 | U2.2 21.19,35.55 20.83,35.06 v20.83,33.28
USB_ID
  Bottom 0.305: U7.45 68.29,11.47 70.62,9.15 R31.2
USB_VBUS
  Bottom 0.305: R43.2 76.71,3.18 75.7,2.16 67.44,2.16 65.03,4.58 65.03,10.42 64.48,10.97 U7.46
VCC  (via drill 0.6)
  Top 0.305: C80.+ 78.81,31.75 v78.83,31.73
  Top 0.406: v20.83,40.14 C82.+
  Top 0.61: v79.72,31.73 79.09,31.43 C80.+ 77.6,31.75 75.82,29.98 61.73,29.98 50.93,40.77 49.56,40.77 C58.+ 49.48,40.77 30.1,40.77 28.71,39.37 23.5,39.37 22.74,40.14 v20.83,40.14
  Bottom 0.406: U1.18 78.68,32.51 C19.2 | C13.2 20.53,40.14 v20.83,40.14 20.62,40.09 U2.9
  Bottom 0.61: C19.2 79.35,31.61 v79.72,31.73 | 49.53,40.82 49.53,44.67 C90.+
  Bottom 0.813: U5.2 49.53,40.82 C58.+ | v19.97,40.14 C13.2
VDD  (via drill 0.6)
  Top 0.61: SV4.2 29.59,4.45 29.59,2.54 30.74,1.4 60.58,1.4 63.76,4.58 63.76,9.91 68.71,14.86 85.54,14.86 | L1.1 17.66,35.25 17.66,34.93 18.55,34.04 18.55,25.28
  Top 0.813: L3.1 C89.+ 80.78,19.43 56.01,19.43 54.87,20.58 46.74,20.58 45.6,21.72 42.3,21.72 41.66,21.09 40.26,21.09 v39.25,22.1 | 85.54,14.86 v85.6,14.88 | 18.55,25.28 19.94,23.88 29.59,23.88 v31.37,22.1
  Bottom 0.813: 85.52,13.68 85.6,13.59 | v31.37,22.1 v39.25,22.1
  Bottom 1.016: SJ2.1 85.6,13.59 v85.6,14.88 v85.6,15.75 C89.+ 86.24,24.26 87.63,22.86 | IC6.3 85.52,13.68 | SJ1.1 87.63,22.86 | D3.C 87.63,22.86

### Text on the board
Top: TOP
Bottom: chybeji montazni otvory | BOTTOM
tNames: INPUTS | OUTPUTS | USB AD/DA | (c) Lukaso 2014 | UART | POWER | IO | JTAG